# Altium project Hub.PrjPcb (part 1 of 2)
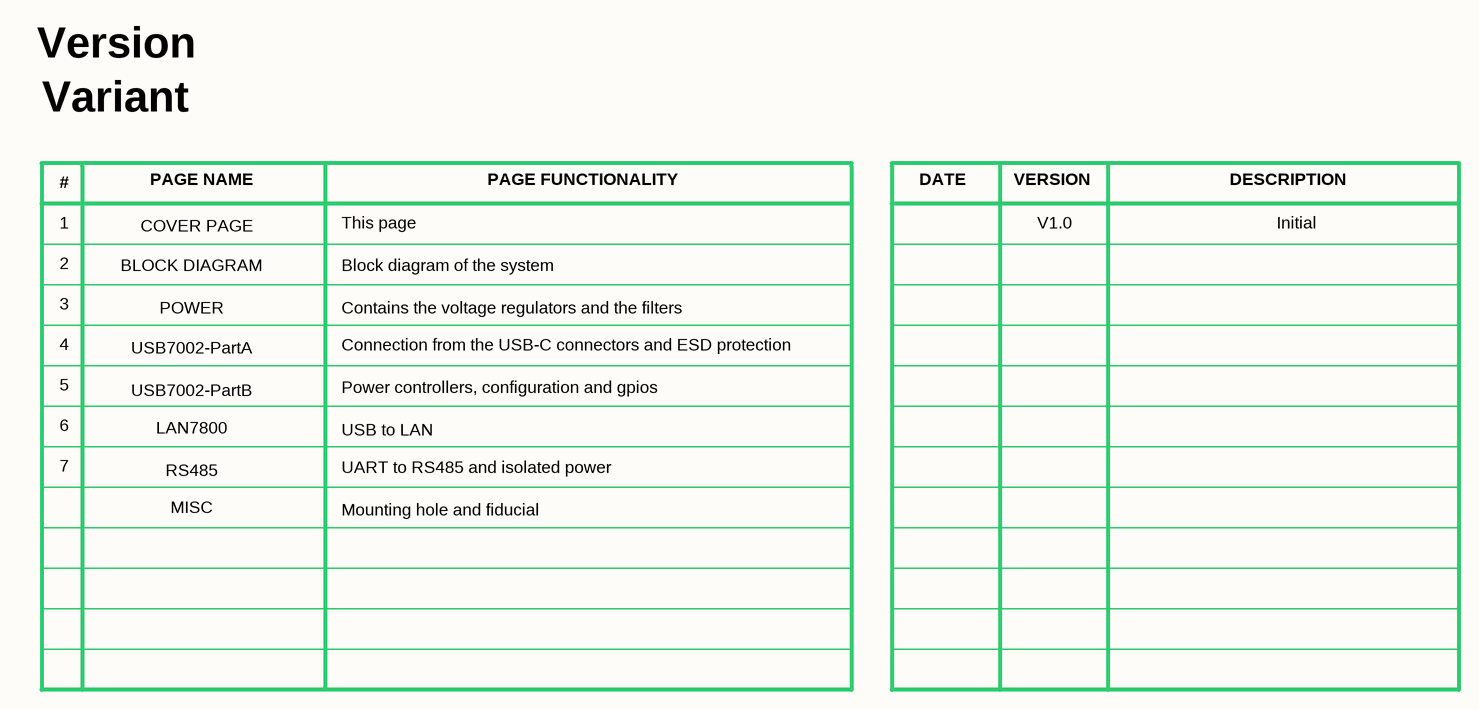
[diagram p0: 01 COVER PAGE.SchDoc]
Engineer_Name: Silard Gal; Global_version: 1.0
8 sheets, 268 parts. Net scope: flat (ports and power ports of the same name join across sheets).
Board file: PCB.PcbDoc
Sheets:
  01 COVER PAGE.SchDoc
  02 BLOCK DIAGRAM.SchDoc
  03 POWER.SchDoc
  04 USB7002-PartA.SchDoc
  05 USB7002-PartB.SchDoc
  06 LAN7800.SchDoc
  07 RS485.SchDoc
  08 MISC.SchDoc

## Sheet 01 COVER PAGE.SchDoc: COVER PAGE
size 420 x 297 mm; SheetNumber: 1; SheetTotal: 8

### Notes on the sheet
- Version
- Variant
- #
- 1
- PAGE NAME
- COVER PAGE
- This page
- PAGE FUNCTIONALITY
- DATE
- VERSION
- V1.0
- DESCRIPTION
- Initial
- 2
- POWER
- BLOCK DIAGRAM
- Contains the voltage regulators and the filters
- Block diagram of the system
- 3
- 4
- USB7002-PartA
- Connection from the USB-C connectors and ESD protection
- 5
- 6
- USB7002-PartB
- LAN7800
- Power controllers, configuration and gpios
- USB to LAN
- 7
- RS485
- MISC
- UART to RS485 and isolated power
- Mounting hole and fiducial
- Title
- Project
- Size
- Date
- Revision
- A3
- Designed By

## Sheet 02 BLOCK DIAGRAM.SchDoc: BLOCK DIAGRAM
size 420 x 297 mm; SheetNumber: 2; SheetTotal: 8
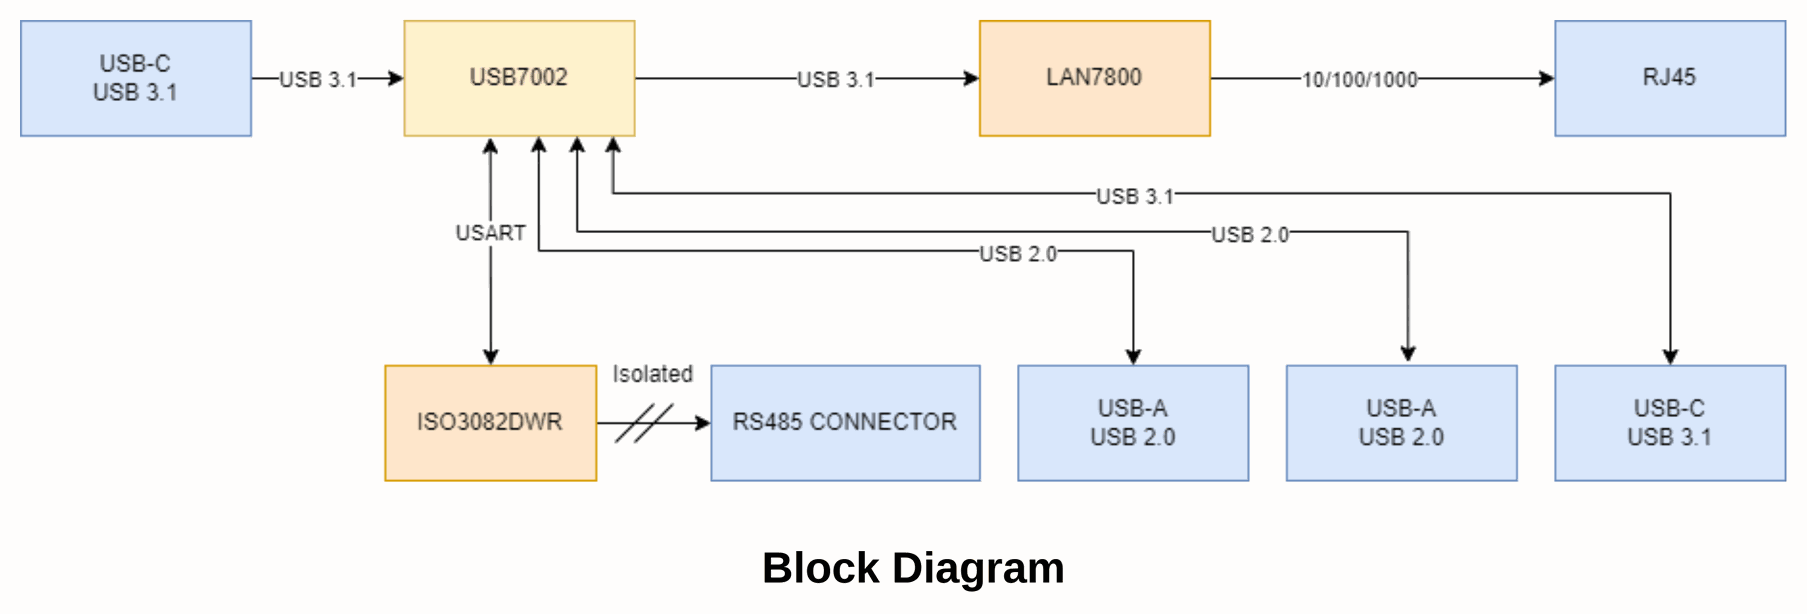
[diagram p1: 02 BLOCK DIAGRAM.SchDoc]

### Notes on the sheet
- Block Diagram
- Title
- Project
- Size
- Date
- Revision
- A3
- Designed By

## Sheet 03 POWER.SchDoc: POWER
size 420 x 297 mm; SheetNumber: 2; SheetTotal: 7
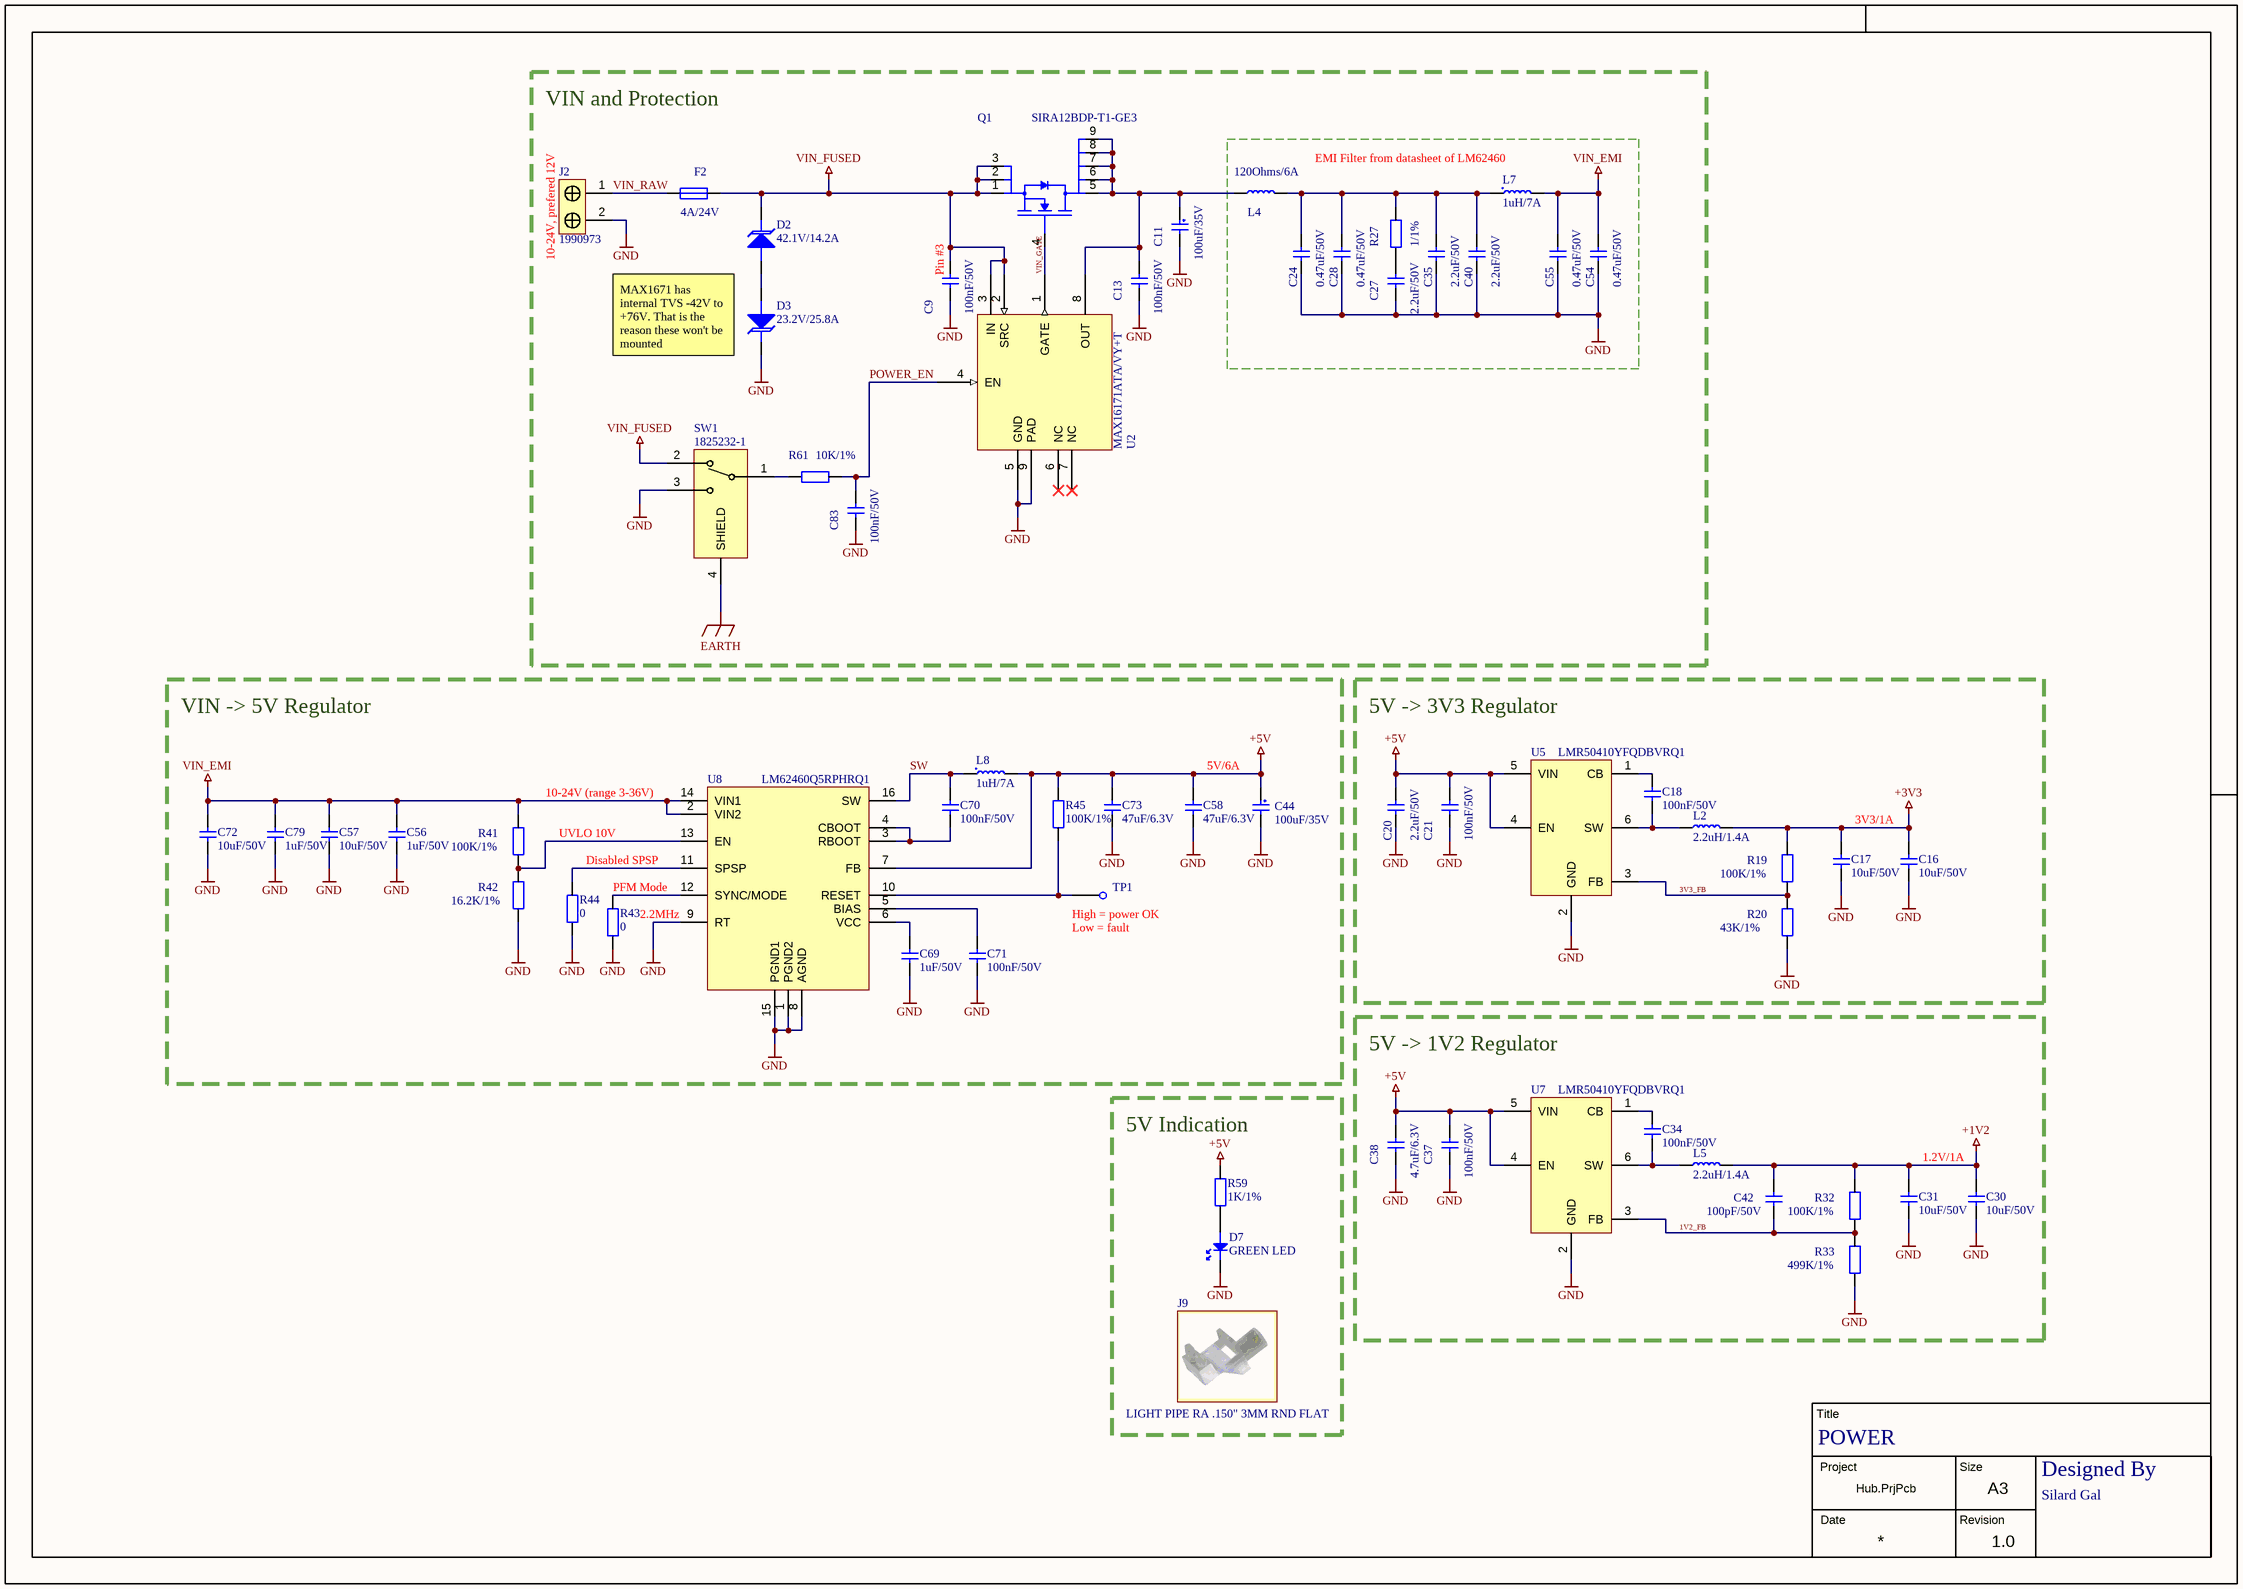
[diagram p2: 03 POWER.SchDoc]

### Parts
C9  100nF/50V  [CAPC1005X06N]
C11  100uF/35V  [CAPAE11580X70M]
C13  100nF/50V  [CAPC1005X06N]
C16  10uF/50V  [CAPC3216X18N]
C17  10uF/50V  [CAPC3216X18N]
C18  100nF/50V  [CAPC1005X06N]
C20  2.2uF/50V  [INDC1608X10N]
C21  100nF/50V  [CAPC1005X06N]
C24  0.47uF/50V  [INDC1608X10N]
C27  2.2uF/50V  [INDC1608X10N]
C28  0.47uF/50V  [INDC1608X10N]
C30  10uF/50V  [CAPC3216X18N]
C31  10uF/50V  [CAPC3216X18N]
C34  100nF/50V  [CAPC1005X06N]
C35  2.2uF/50V  [INDC1608X10N]
C37  100nF/50V  [CAPC1005X06N]
C38  4.7uF/6.3V  [CAPC1005X06N]
C40  2.2uF/50V  [INDC1608X10N]
C42  100pF/50V  [CAPC1005X06N]
C44  100uF/35V  [CAPAE11580X70M]
C54  0.47uF/50V  [INDC1608X10N]
C55  0.47uF/50V  [INDC1608X10N]
C56  1uF/50V  [INDC1608X10N]
C57  10uF/50V  [CAPC3216X18N]
C58  47uF/6.3V  [INDC1608X10N]
C69  1uF/50V  [INDC1608X10N]
C70  100nF/50V  [CAPC1005X06N]
C71  100nF/50V  [CAPC1005X06N]
C72  10uF/50V  [CAPC3216X18N]
C73  47uF/6.3V  [INDC1608X10N]
C79  1uF/50V  [INDC1608X10N]
C83  100nF/50V  [CAPC1005X06N]
D2  42.1V/14.2A  [DIOM4739X26N]
D3  23.2V/25.8A  [DIOM4739X26N]
D7  GREEN LED  [DIOC1608X06L]
F2  4A/24V  [INDC7451X08N]
J2  1990973  [1990973]
J9  LIGHT PIPE RA .150" 3MM RND FLAT  [SLP3-150-150-F]
L2  2.2uH/1.4A  [INDP2016X12N]
L4  120Ohms/6A  [INDC3216X18N]
L5  2.2uH/1.4A  [INDP2016X12N]
L7  1uH/7A  [INDP5752X20N]  (net tie)
L8  1uH/7A  [INDP5752X20N]  (net tie)
Q1  SIRA12BDP-T1-GE3  [POWERPAK-SO-8-Single]
R19  100K/1%  [RESC1005X04N]
R20  43K/1%  [RESC1005X04N]
R27  1/1%  [RESC1608X04N]
R32  100K/1%  [RESC1005X04N]
R33  499K/1%  [RESC1005X04N]
R41  100K/1%  [RESC1005X04N]
R42  16.2K/1%  [RESC1005X04N]
R43  0  [RESC1005X04N]
R44  0  [RESC1005X04N]
R45  100K/1%  [RESC1005X04N]
R59  1K/1%  [RESC1005X04N]
R61  10K/1%  [RESC1005X04N]
SW1  1825232-1  [1825232-1]
TP1  Test Point 1mm  [TEST_POINT_1mm]  (value not drawn)
U2  MAX16171ATA/VY+T  [PSON50P300X80_HS-9N]
U5  LMR50410YFQDBVRQ1  [SOT95P280X145-6N]
U7  LMR50410YFQDBVRQ1  [SOT95P280X145-6N]
U8  LM62460Q5RPHRQ1  [VQFN-HR]

### Blocks framed on the sheet
VIN and Protection: C9 C11 C13 C83 D2 D3 F2 J2 Q1 R61 SW1 U2
EMI Filter from datasheet of LM62460: C24 C27 C28 C35 C40 C54 C55 L4 L7 R27
VIN -> 5V Regulator: C44 C56-C58 C69-C73 C79 L8 R41-R45 TP1 U8
5V -> 3V3 Regulator: C16-C18 C20 C21 L2 R19 R20 U5
5V -> 1V2 Regulator: C30 C31 C34 C37 C38 C42 L5 R32 R33 U7
5V Indication: D7 J9 R59

### Nets
+1V2: C30.2 C31.2 C42.2 L5.2 R32.2
+3V3: C16.2 C17.2 L2.2 R19.2
+5V: C20.2 C21.2 C37.2 C38.2 C44.1 C58.2 C73.2 L8.2 R45.1 R59.2 U5.4(EN) U5.5(VIN) U7.4(EN) U7.5(VIN) U8.7(FB)
EARTH: SW1.4(SHIELD)
GND: C9.1 C11.2 C13.1 C16.1 C17.1 C20.1 C21.1 C24.1 C27.1 C28.1 C30.1 C31.1 C35.1 C37.1 C38.1 C40.1 C44.2 C54.1 C55.1 C56.1 C57.1 C58.1 C69.1 C71.1 C72.1 C73.1 C79.1 C83.1 D3.1 D7.1 J2.2 R20.1 R33.1 R42.1 R43.1 R44.1 SW1.3 U2.5(GND) U2.9(PAD) U5.2(GND) U7.2(GND) U8.1(PGND2) U8.8(AGND) U8.9(RT) U8.15(PGND1)
VIN_EMI: C54.2 C55.2 C56.2 C57.2 C72.2 C79.2 L7.2 R41.2 U8.2(VIN2) U8.14(VIN1)
VIN_FUSED: C9.2 D2.1 F2.2 Q1.1 Q1.2 Q1.3 SW1.2 U2.2(SRC) U2.3(IN)
1V2_FB: C42.1 R32.1 R33.2 U7.3(FB)
3V3_FB: R19.1 R20.2 U5.3(FB)
POWER_EN: C83.2 R61.2 U2.4(EN)
SW: C70.2 L8.1 U8.16(SW)
VIN_GATE: Q1.4 U2.1(GATE)
VIN_RAW: F2.1 J2.1
NetC11_1: C11.1 C13.2 L4.1 Q1.5 Q1.6 Q1.7 Q1.8 Q1.9 U2.8(OUT)
NetC18_1: C18.1 L2.1 U5.6(SW)
NetC18_2: C18.2 U5.1(CB)
NetC24_2: C24.2 C28.2 C35.2 C40.2 L4.2 L7.1 R27.2
NetC27_2: C27.2 R27.1
NetC34_1: C34.1 L5.1 U7.6(SW)
NetC34_2: C34.2 U7.1(CB)
NetC69_2: C69.2 U8.6(VCC)
NetC70_1: C70.1 U8.3(RBOOT) U8.4(CBOOT)
NetC71_2: C71.2 U8.5(BIAS)
NetD2_2: D2.2 D3.2
NetD7_2: D7.2 R59.1
NetR41_1: R41.1 R42.2 U8.13(EN)
NetR43_2: R43.2 U8.12(SYNC/MODE)
NetR44_2: R44.2 U8.11(SPSP)
NetR45_2: R45.2 TP1.1 U8.10(RESET)
NetR61_1: R61.1 SW1.1

Not connected (* = marked no-connect by the designer): U2 6(NC)* 7(NC)*

### Notes on the sheet
- (near J2) 10-24V, prefered 12V
- (near C9) Pin #3
- MAX1671 has internal TVS -42V to +76V. That is the reason these won't be mounted
- 10-24V (range 3-36V)
- 5V/6A
- UVLO 10V
- Disabled SPSP
- 3V3/1A
- (near R43) PFM Mode
- 2.2MHz
- (near TP1) High = power OK
- (near TP1) Low = fault
- 1.2V/1A
- Title
- Project
- Size
- Date
- Revision
- A3
- Designed By

### Library data of the parts
C9 C13 C18 C21 C34 C37 C70 C71 C83 = GCM155R71H104KE02J: 0.1 µF ±10% 50V Ceramic Capacitor X7R 0402 (1005 Metric); manufacturer: Murata Electronics; mfr_part_number: GCM155R71H104KE02J; assembler_number: GCM155R71H104KE02J; datasheet: https://search.murata.co.jp/Ceramy/image/img/A01X/G101/ENG/GCM155R71H104KE02-01.pdf
C11 C44 = A769KE107M1VLAS031: 100 µF 35 V Aluminum - Polymer Capacitors Radial, Can - SMD 2000 Hrs @ 125°C; manufacturer: KEMET; mfr_part_number: A769KE107M1VLAS031; assembler_number: A769KE107M1VLAS031; datasheet: https://connect.kemet.com:7667/gateway/IntelliData-ComponentDocumentation/1.0/download/datasheet/A769KE107M1VLAS031
C16 C17 C30 C31 C57 C72 = GRT31CR61H106ME01L: 10 µF ±20% 50V Ceramic Capacitor X5R 1206 (3216 Metric); manufacturer: Murata Electronics; mfr_part_number: GRT31CR61H106ME01L; assembler_number: GRT31CR61H106ME01L; datasheet: https://search.murata.co.jp/Ceramy/image/img/A01X/G101/ENG/GRT31CR61H106ME01-01.pdf
C20 C27 C35 C40 = GRT188R61H225ME13D: 2.2 µF ±20% 50V Ceramic Capacitor X5R 0603 (1608 Metric); manufacturer: Murata Electronics; mfr_part_number: GRT188R61H225ME13D; assembler_number: GRT188R61H225ME13D; datasheet: https://search.murata.co.jp/Ceramy/image/img/A01X/G101/ENG/GRT188R61H225ME13-01.pdf
C24 C28 C54 C55 = CGA3E3X7R1H474K080AB: 0.47 µF ±10% 50V Ceramic Capacitor X7R 0603 (1608 Metric); manufacturer: TDK Corporation; mfr_part_number: CGA3E3X7R1H474K080AB; assembler_number: CGA3E3X7R1H474K080AB; datasheet: https://product.tdk.com/system/files/dam/doc/product/capacitor/ceramic/mlcc/catalog/mlcc_automotive_general_en.pdf
C38 = JMK105BBJ475MVHF: 4.7 µF ±20% 6.3V Ceramic Capacitor X5R 0402 (1005 Metric); manufacturer: Taiyo Yuden; mfr_part_number: JMK105BBJ475MVHF; assembler_number: JMK105BBJ475MVHF; datasheet: https://media.digikey.com/pdf/Data%20Sheets/Taiyo%20Yuden%20PDFs%20URL%20links/JMK105BBJ475MVHF_SS.pdf
C42 = GCM1555C1H101JA16D: 100 pF ±5% 50V Ceramic Capacitor C0G, NP0 0402 (1005 Metric); manufacturer: Murata Electronics; mfr_part_number: GCM1555C1H101JA16D; assembler_number: GCM1555C1H101JA16D; datasheet: https://www.murata.com/-/media/webrenewal/support/library/catalog/products/k35e.ashx?la=en-us&cvid=20200508021757000000
C56 C69 C79 = GRT188R61H105KE13D: 1 µF ±10% 50V Ceramic Capacitor X5R 0603 (1608 Metric); manufacturer: Murata Electronics; mfr_part_number: GRT188R61H105KE13D; assembler_number: GRT188R61H105KE13D; datasheet: https://search.murata.co.jp/Ceramy/image/img/A01X/G101/ENG/GRT188R61H105KE13-01.pdf
C58 C73 = GRM188R60J476ME15D: 47 µF ±20% 6.3V Ceramic Capacitor X5R 0603 (1608 Metric); manufacturer: Murata Electronics; mfr_part_number: GRM188R60J476ME15D; assembler_number: GRM188R60J476ME15D; datasheet: https://search.murata.co.jp/Ceramy/image/img/A01X/G101/ENG/GRM188R60J476ME15-01.pdf
D2 = SMBJ26A-13-F: 42.1V Clamp 14.2A Ipp Tvs Diode Surface Mount SMB; manufacturer: Diodes Incorporated; mfr_part_number: SMBJ26A-13-F; assembler_number: SMBJ26A-13-F; datasheet: https://www.diodes.com/assets/Datasheets/ds19002.pdf
D3 = SMBJ14A-13-F: 23.2V Clamp 25.8A Ipp Tvs Diode Surface Mount SMB; manufacturer: Diodes Incorporated; mfr_part_number: SMBJ14A-13-F; assembler_number: SMBJ14A-13-F; datasheet: https://www.diodes.com/assets/Datasheets/ds19002.pdf
D7 = LTST-C191KGKT: White 0402 Light Emitting Diodes (LED) RoHS; manufacturer: Lite-On Inc.; mfr_part_number: LTST-C191KGKT; assembler_number: LTST-C191KGKT; datasheet: https://optoelectronics.liteon.com/upload/download/DS22-2000-228/LTST-C191KGKT.PDF
F2 = 0ZCF0200AF2C: Polymeric PTC Resettable Fuse 24V 2 A Ih Surface Mount 2920 (7351 Metric), Concave - 4A trip; manufacturer: Bel Fuse Inc.; mfr_part_number: 0ZCF0200AF2C; assembler_number: 0ZCF0200AF2C; datasheet: https://www.belfuse.com/resources/datasheets/circuitprotection/ds-cp-0zcf-series.pdf
J2 = 1990973: 2 Position Wire to Board Terminal Block Horizontal with Board 0.197" (5.00mm) Through Hole; manufacturer: Phoenix Contact; mfr_part_number: 1990973; assembler_number: 1990973; datasheet: https://www.phoenixcontact.com/en-pc/products/pcb-terminal-block-spt-25-2-h-50-1990973
J9 = SLP3-150-150-F: Light Pipe Single Clear Rigid Board Mount, Press Fit, Right Angle; manufacturer: Bivar Inc.; mfr_part_number: SLP3-150-150-F; assembler_number: SLP3-150-150-F; datasheet: https://www.bivar.com/parts_content/Datasheets/SLP3-150-XXX-X.pdf
L2 L5 = TYA2016102R2M-10: 2.2 µH Shielded Drum Core, Wirewound Inductor 1.4 A 180mOhm Max 0806 (2016 Metric); manufacturer: Laird-Signal Integrity Products; mfr_part_number: TYA2016102R2M-10; assembler_number: TYA2016102R2M-10; datasheet: https://www.laird.com/sites/default/files/tya201610-series-datasheet.pdf
L4 = BLM31KN121SN1L: 120 Ohms @ 100 MHz 1 Power Line Ferrite Bead 1206 (3216 Metric) 6A 9mOhm; manufacturer: Murata Electronics; mfr_part_number: BLM31KN121SN1L; assembler_number: BLM31KN121SN1L; datasheet: https://www.murata.com/en-us/products/productdata/8801529331742/ENFA0091.pdf
L7 L8 = SRP5020TA-1R0M: 1 µH Shielded Drum Core, Wirewound Inductor 7 A 20mOhm Max Nonstandard; manufacturer: Bourns Inc.; mfr_part_number: SRP5020TA-1R0M; assembler_number: SRP5020TA-1R0M; datasheet: https://www.bourns.com/docs/Product-Datasheets/SRP5020TA.pdf
Q1 = SIRA12BDP-T1-GE3: N-Channel 30 V 27A (Ta), 60A (Tc) 5W (Ta), 38W (Tc) Surface Mount PowerPAK® SO-8; manufacturer: Vishay Siliconix; mfr_part_number: SIRA12BDP-T1-GE3; assembler_number: SIRA12BDP-T1-GE3; datasheet: https://www.vishay.com/docs/76390/sira12bdp.pdf
R19 R32 R41 R45 = RMCF0402FT100K: 100 kOhms ±1% 0.063W, 1/16W Chip Resistor 0402 (1005 Metric) Automotive AEC-Q200 Thick Film; manufacturer: Stackpole Electronics Inc; mfr_part_number: RMCF0402FT100K; assembler_number: RMCF0402FT100K; datasheet: https://www.seielect.com/Catalog/SEI-RMCF_RMCP.pdf
R20 = ERJ-2RKF4302X: 43 kOhms ±1% 0.1W, 1/10W Chip Resistor 0402 (1005 Metric) Automotive AEC-Q200 Thick Film; manufacturer: Panasonic Electronic Components; mfr_part_number: ERJ-2RKF4302X; assembler_number: ERJ-2RKF4302X; datasheet: https://industrial.panasonic.com/cdbs/www-data/pdf/RDA0000/AOA0000C304.pdf
R27 = RMCF0603FT1R00: 1 Ohms ±1% 0.1W, 1/10W Chip Resistor 0603 (1608 Metric) Automotive AEC-Q200 Thick Film; manufacturer: Stackpole Electronics Inc; mfr_part_number: RMCF0603FT1R00; assembler_number: RMCF0603FT1R00; datasheet: https://www.seielect.com/Catalog/SEI-RMCF_RMCP.pdf
R33 = RMCF0402FT499K: 499 kOhms ±1% 0.063W, 1/16W Chip Resistor 0402 (1005 Metric) Automotive AEC-Q200 Thick Film; manufacturer: Stackpole Electronics Inc; mfr_part_number: RMCF0402FT499K; assembler_number: RMCF0402FT499K; datasheet: https://www.seielect.com/Catalog/SEI-RMCF_RMCP.pdf
R42 = ERJ-2RKF1622X: 16.2 kOhms ±1% 0.1W, 1/10W Chip Resistor 0402 (1005 Metric) Automotive AEC-Q200 Thick Film; manufacturer: Panasonic Electronic Components; mfr_part_number: ERJ-2RKF1622X; assembler_number: ERJ-2RKF1622X; datasheet: https://industrial.panasonic.com/cdbs/www-data/pdf/RDA0000/AOA0000C304.pdf
R43 R44 = 0402WGF0000TCE: 62.5mW Thick Film Resistors 50V ±800ppm/℃ ±1% -55℃~+155℃ 0Ω 0402  Chip Resistor - Surface Mount ROHS; manufacturer: UNI-ROYAL(Uniroyal Elec); assembler_number: C17168; mfr_part_number: 0402WGF0000TCE; datasheet: https://datasheet.lcsc.com/lcsc/2206010216_UNI-ROYAL-Uniroyal-Elec-0402WGF0000TCE_C17168.pdf
R59 = RMCF0402FT1K00: 1 kOhms ±1% 0.063W, 1/16W Chip Resistor 0402 (1005 Metric) Automotive AEC-Q200 Thick Film; manufacturer: Stackpole Electronics Inc; mfr_part_number: RMCF0402FT1K00; assembler_number: RMCF0402FT1K00; datasheet: https://www.seielect.com/Catalog/SEI-RMCF_RMCP.pdf
R61 = RMCF0402FT10K0: 10 kOhms ±1% 0.063W, 1/16W Chip Resistor 0402 (1005 Metric) Automotive AEC-Q200 Thick Film; manufacturer: Stackpole Electronics Inc; mfr_part_number: RMCF0402FT10K0; assembler_number: RMCF0402FT10K0; datasheet: https://www.seielect.com/Catalog/SEI-RMCF_RMCP.pdf
SW1 = 1825232-1: Slide Switch SPDT Through Hole, Right Angle; manufacturer: TE Connectivity ALCOSWITCH Switches; mfr_part_number: 1825232-1; assembler_number: 1825232-1; datasheet: https://www.te.com/commerce/DocumentDelivery/DDEController?Action=srchrtrv&DocNm=1825232&DocType=Customer+Drawing&DocLang=English&DocFormat=pdf&PartCntxt=1825232-1
TP1 = TestPoint
U2 = MAX16171ATA/VY+T: OR Controller N+1 ORing Controller N-Channel 1:1 8-TDFN-CU (2x3); manufacturer: Analog Devices Inc./Maxim Integrated; mfr_part_number: MAX16171ATA/VY+T; assembler_number: MAX16171ATA/VY+T; datasheet: https://datasheets.maximintegrated.com/en/ds/MAX16171.pdf
U5 U7 = LMR50410YFQDBVRQ1: Buck Switching Regulator IC Positive Adjustable 1V 1 Output 1A SOT-23-6; manufacturer: Texas Instruments; mfr_part_number: LMR50410YFQDBVRQ1; assembler_number: LMR50410YFQDBVRQ1; datasheet: https://www.ti.com/lit/ds/symlink/lmr50410-q1.pdf
U8 = LM62460Q5RPHRQ1: Switching Voltage Regulators 6-A automotive buck converter optimized for power density and low EMI; manufacturer: Texas Instruments; mfr_part_number: LM62460Q5RPHRQ1; assembler_number: LM62460Q5RPHRQ1; datasheet: https://www.ti.com/general/docs/suppproductinfo.tsp?distId=26&gotoUrl=https://www.ti.com/lit/gpn/lm62460-q1

## Sheet 04 USB7002-PartA.SchDoc: USB7002 - Part A
size 420 x 297 mm; SheetNumber: 3; SheetTotal: 7
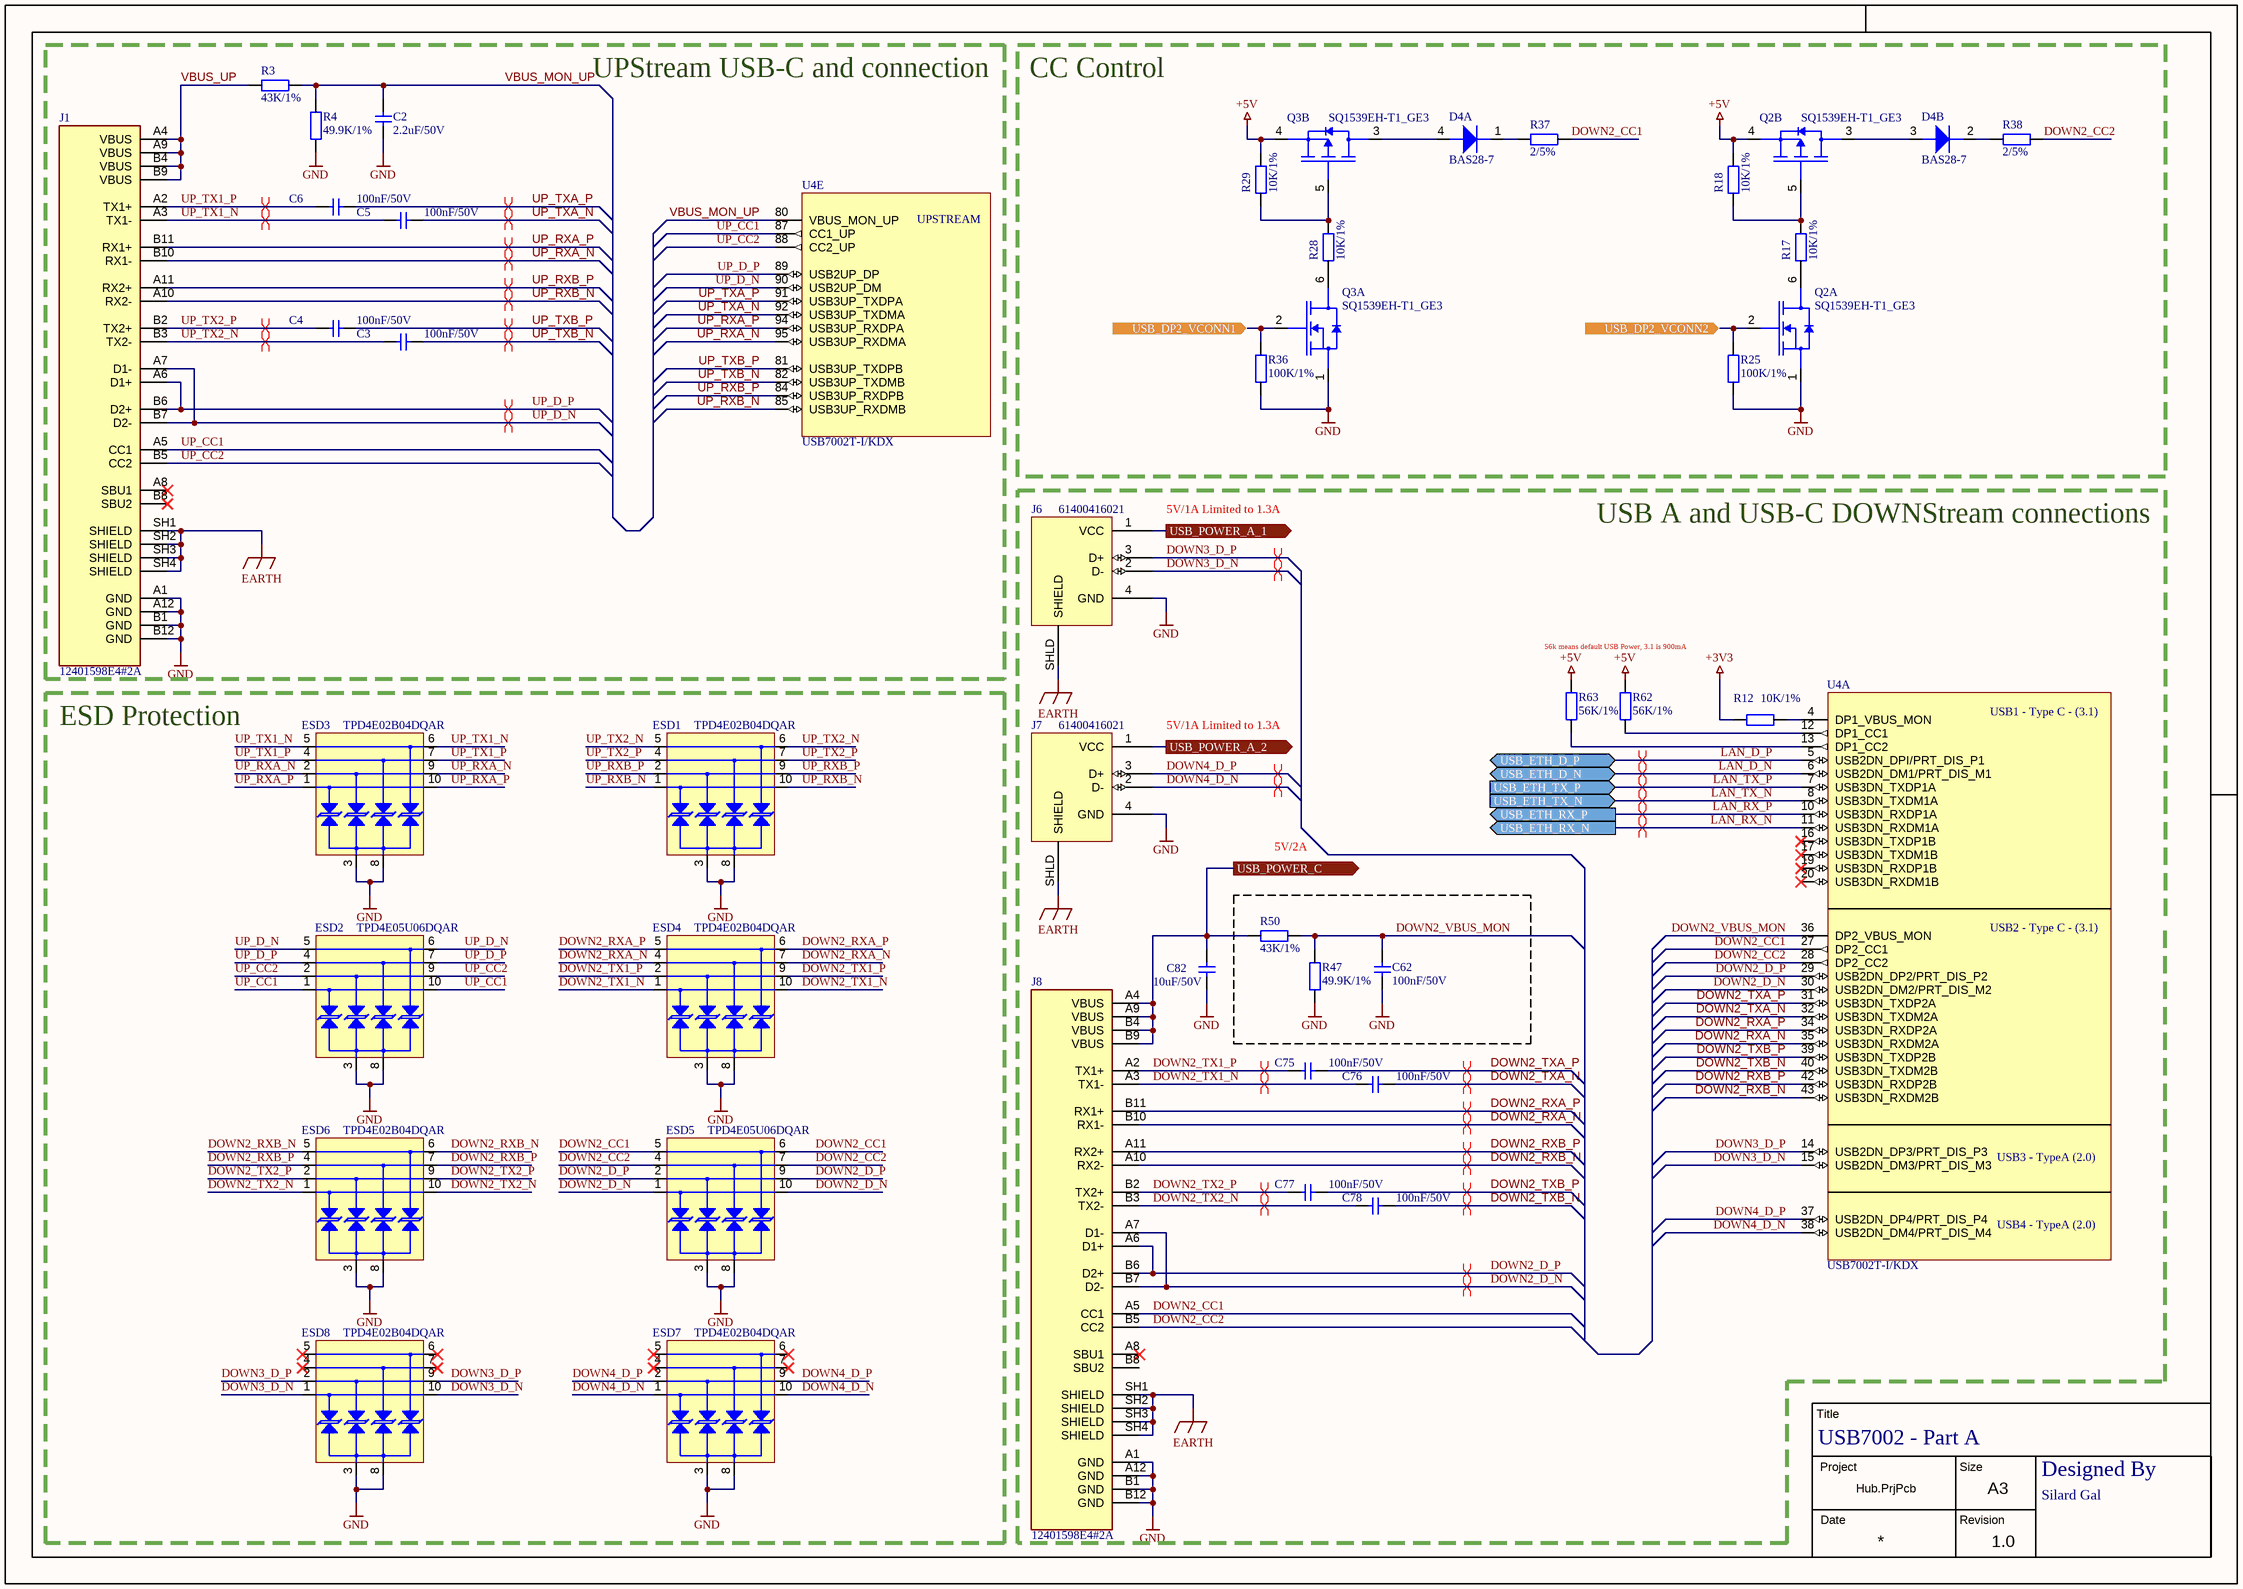
[diagram p3: 04 USB7002-PartA.SchDoc]

### Parts
C2  2.2uF/50V  [INDC1608X10N]
C3  100nF/50V  [CAPC1005X06N]
C4  100nF/50V  [CAPC1005X06N]
C5  100nF/50V  [CAPC1005X06N]
C6  100nF/50V  [CAPC1005X06N]
C62  100nF/50V  [CAPC1005X06N]
C75  100nF/50V  [CAPC1005X06N]
C76  100nF/50V  [CAPC1005X06N]
C77  100nF/50V  [CAPC1005X06N]
C78  100nF/50V  [CAPC1005X06N]
C82  10uF/50V  [CAPC3216X18N]
D4  BAS28-7  [SOT190P238X100-4L]  (parts A,B of 2)
ESD1  TPD4E02B04DQAR  [USON50P11X26X055]
ESD2  TPD4E05U06DQAR  [USON50P11X26X055]
ESD3  TPD4E02B04DQAR  [USON50P11X26X055]
ESD4  TPD4E02B04DQAR  [USON50P11X26X055]
ESD5  TPD4E05U06DQAR  [USON50P11X26X055]
ESD6  TPD4E02B04DQAR  [USON50P11X26X055]
ESD7  TPD4E02B04DQAR  [USON50P11X26X055]
ESD8  TPD4E02B04DQAR  [USON50P11X26X055]
J1  12401598E4#2A  [12401598E4#2A]
J6  61400416021  [61400416021]
J7  61400416021  [61400416021]
J8  12401598E4#2A  [12401598E4#2A]
Q2  SQ1539EH-T1_GE3  [SOT65P195X110-6N]  (parts A,B of 2)
Q3  SQ1539EH-T1_GE3  [SOT65P195X110-6N]  (parts A,B of 2)
R3  43K/1%  [RESC1005X04N]
R4  49.9K/1%  [RESC1005X04N]
R12  10K/1%  [RESC1005X04N]
R17  10K/1%  [RESC1005X04N]
R18  10K/1%  [RESC1005X04N]
R25  100K/1%  [RESC1005X04N]
R28  10K/1%  [RESC1005X04N]
R29  10K/1%  [RESC1005X04N]
R36  100K/1%  [RESC1005X04N]
R37  2/5%  [RESC1608X04N]
R38  2/5%  [RESC1608X04N]
R47  49.9K/1%  [RESC1005X04N]
R50  43K/1%  [RESC1005X04N]
R62  56K/1%  [RESC1005X04N]
R63  56K/1%  [RESC1005X04N]
U4  USB7002T-I/KDX  [QFN40P1200X1200X90_HS-101N]  (parts A,E of 5)

### Blocks framed on the sheet
UPStream USB-C and connection: C2-C6 J1 R3 R4 U4
CC Control: D4 Q2 Q3 R17 R18 R25 R28 R29 R36-R38
USB A and USB-C DOWNStream connections: C62 C75-C78 C82 J6-J8 R12 R47 R50 R62 R63 U4
ESD Protection: ESD1-ESD8

### Ports
USB_DP2_VCONN1 (in), USB_DP2_VCONN2 (in), USB_ETH_D_N (bidir), USB_ETH_D_P (bidir), USB_ETH_RX_N (out), USB_ETH_RX_P (out), USB_ETH_TX_N (in), USB_ETH_TX_P (in), USB_POWER_A_1 (out), USB_POWER_A_2 (out), USB_POWER_C (out)

### Nets
+3V3: R12.1
+5V: Q2.4 Q3.4 R18.1 R29.1 R62.1 R63.1
EARTH: J1.SH1(SHIELD) J1.SH2(SHIELD) J1.SH3(SHIELD) J1.SH4(SHIELD) J6.SHLD(SHIELD) J7.SHLD(SHIELD) J8.SH1(SHIELD) J8.SH2(SHIELD) J8.SH3(SHIELD) J8.SH4(SHIELD)
GND: C2.1 C62.2 C82.1 ESD1.3(GND) ESD1.8(GND) ESD2.3(GND) ESD2.8(GND) ESD3.3(GND) ESD3.8(GND) ESD4.3(GND) ESD4.8(GND) ESD5.3(GND) ESD5.8(GND) ESD6.3(GND) ESD6.8(GND) ESD7.3(GND) ESD7.8(GND) ESD8.3(GND) ESD8.8(GND) J1.A1(GND) J1.A12(GND) J1.B1(GND) J1.B12(GND) J6.4(GND) J7.4(GND) J8.A1(GND) J8.A12(GND) J8.B1(GND) J8.B12(GND) Q2.1(S1) Q3.1(S1) R4.1 R25.2 R36.2 R47.1
DOWN2_CC1: ESD5.5(IO4) ESD5.6(NC) J8.A5(CC1) R37.2 U4.27(DP2_CC1)
DOWN2_CC2: ESD5.4(IO3) ESD5.7(NC) J8.B5(CC2) R38.2 U4.28(DP2_CC2)
DOWN2_D_N: ESD5.1(IO1) ESD5.10(NC) J8.A7(D1-) J8.B7(D2-) U4.30(USB2DN_DM2/PRT_DIS_M2)
DOWN2_D_P: ESD5.2(IO2) ESD5.9(NC) J8.A6(D1+) J8.B6(D2+) U4.29(USB2DN_DP2/PRT_DIS_P2)
DOWN2_RXA_N: ESD4.4(IO3) ESD4.7(NC) J8.B10(RX1-) U4.35(USB3DN_RXDM2A)
DOWN2_RXA_P: ESD4.5(IO4) ESD4.6(NC) J8.B11(RX1+) U4.34(USB3DN_RXDP2A)
DOWN2_RXB_N: ESD6.5(IO4) ESD6.6(NC) J8.A10(RX2-) U4.43(USB3DN_RXDM2B)
DOWN2_RXB_P: ESD6.4(IO3) ESD6.7(NC) J8.A11(RX2+) U4.42(USB3DN_RXDP2B)
DOWN2_TX1_N: C76.2 ESD4.1(IO1) ESD4.10(NC) J8.A3(TX1-)
DOWN2_TX1_P: C75.2 ESD4.2(IO2) ESD4.9(NC) J8.A2(TX1+)
DOWN2_TX2_N: C78.2 ESD6.1(IO1) ESD6.10(NC) J8.B3(TX2-)
DOWN2_TX2_P: C77.2 ESD6.2(IO2) ESD6.9(NC) J8.B2(TX2+)
DOWN2_TXA_N: C76.1 U4.32(USB3DN_TXDM2A)
DOWN2_TXA_P: C75.1 U4.31(USB3DN_TXDP2A)
DOWN2_TXB_N: C78.1 U4.40(USB3DN_TXDM2B)
DOWN2_TXB_P: C77.1 U4.39(USB3DN_TXDP2B)
DOWN2_VBUS_MON: C62.1 R47.2 R50.1 U4.36(DP2_VBUS_MON)
DOWN3_D_N: ESD8.1(IO1) ESD8.10(NC) J6.2(D-) U4.15(USB2DN_DM3/PRT_DIS_M3)
DOWN3_D_P: ESD8.2(IO2) ESD8.9(NC) J6.3(D+) U4.14(USB2DN_DP3/PRT_DIS_P3)
DOWN4_D_N: ESD7.1(IO1) ESD7.10(NC) J7.2(D-) U4.38(USB2DN_DM4/PRT_DIS_M4)
DOWN4_D_P: ESD7.2(IO2) ESD7.9(NC) J7.3(D+) U4.37(USB2DN_DP4/PRT_DIS_P4)
LAN_D_N: U4.6(USB2DN_DM1/PRT_DIS_M1) ; port USB_ETH_D_N
LAN_D_P: U4.5(USB2DN_DPI/PRT_DIS_P1) ; port USB_ETH_D_P
LAN_RX_N: U4.11(USB3DN_RXDM1A) ; port USB_ETH_RX_N
LAN_RX_P: U4.10(USB3DN_RXDP1A) ; port USB_ETH_RX_P
LAN_TX_N: U4.8(USB3DN_TXDM1A) ; port USB_ETH_TX_N
LAN_TX_P: U4.7(USB3DN_TXDP1A) ; port USB_ETH_TX_P
UP_CC1: ESD2.1(IO1) ESD2.10(NC) J1.A5(CC1) U4.87(CC1_UP)
UP_CC2: ESD2.2(IO2) ESD2.9(NC) J1.B5(CC2) U4.88(CC2_UP)
UP_D_N: ESD2.5(IO4) ESD2.6(NC) J1.A7(D1-) J1.B7(D2-) U4.90(USB2UP_DM)
UP_D_P: ESD2.4(IO3) ESD2.7(NC) J1.A6(D1+) J1.B6(D2+) U4.89(USB2UP_DP)
UP_RXA_N: ESD3.2(IO2) ESD3.9(NC) J1.B10(RX1-) U4.95(USB3UP_RXDMA)
UP_RXA_P: ESD3.1(IO1) ESD3.10(NC) J1.B11(RX1+) U4.94(USB3UP_RXDPA)
UP_RXB_N: ESD1.1(IO1) ESD1.10(NC) J1.A10(RX2-) U4.85(USB3UP_RXDMB)
UP_RXB_P: ESD1.2(IO2) ESD1.9(NC) J1.A11(RX2+) U4.84(USB3UP_RXDPB)
UP_TX1_N: C5.2 ESD3.5(IO4) ESD3.6(NC) J1.A3(TX1-)
UP_TX1_P: C6.2 ESD3.4(IO3) ESD3.7(NC) J1.A2(TX1+)
UP_TX2_N: C3.2 ESD1.5(IO4) ESD1.6(NC) J1.B3(TX2-)
UP_TX2_P: C4.2 ESD1.4(IO3) ESD1.7(NC) J1.B2(TX2+)
UP_TXA_N: C5.1 U4.92(USB3UP_TXDMA)
UP_TXA_P: C6.1 U4.91(USB3UP_TXDPA)
UP_TXB_N: C3.1 U4.82(USB3UP_TXDMB)
UP_TXB_P: C4.1 U4.81(USB3UP_TXDPB)
VBUS_MON_UP: C2.2 R3.1 R4.2 U4.80(VBUS_MON_UP)
VBUS_UP: J1.A4(VBUS) J1.A9(VBUS) J1.B4(VBUS) J1.B9(VBUS) R3.2
NetC66_1: J6.1(VCC) ; port USB_POWER_A_1
NetC67_1: J7.1(VCC) ; port USB_POWER_A_2
NetC68_1: C82.2 J8.A4(VBUS) J8.A9(VBUS) J8.B4(VBUS) J8.B9(VBUS) R50.2 ; port USB_POWER_C
NetD4_1: D4.1 R37.1
NetD4_2: D4.2 R38.1
NetD4_3: D4.3 Q2.3
NetD4_4: D4.4 Q3.3
NetQ2_2: Q2.2(S2) R25.1 ; port USB_DP2_VCONN2
NetQ2_5: Q2.5 R17.1 R18.2
NetQ2_6: Q2.6 R17.2
NetQ3_2: Q3.2(S2) R36.1 ; port USB_DP2_VCONN1
NetQ3_5: Q3.5 R28.1 R29.2
NetQ3_6: Q3.6 R28.2
NetR12_2: R12.2 U4.4(DP1_VBUS_MON)
NetR62_2: R62.2 U4.12(DP1_CC1)
NetR63_2: R63.2 U4.13(DP1_CC2)

Not connected (* = marked no-connect by the designer): ESD7 4(IO3)* 5(IO4)* 6(NC)* 7(NC)*; ESD8 4(IO3)* 5(IO4)* 6(NC)* 7(NC)*; J1 A8(SBU1)* B8(SBU2)*; J8 A8(SBU1)* B8(SBU2); U4 16(USB3DN_TXDP1B)* 17(USB3DN_TXDM1B)* 19(USB3DN_RXDP1B)* 20(USB3DN_RXDM1B)*

### Layout directives
differential pair; differential pair class UP_SS: UP_RXA_N, UP_RXA_P, UP_RXB_N, UP_RXB_P, UP_TX1_N, UP_TX1_P, UP_TX2_N, UP_TX2_P, UP_TXA_N, UP_TXA_P, UP_TXB_N, UP_TXB_P
differential pair; differential pair class UP_DPDN: UP_D_N, UP_D_P
differential pair; differential pair class DOWN2_SS: DOWN2_RXA_N, DOWN2_RXA_P, DOWN2_RXB_N, DOWN2_RXB_P, DOWN2_TX1_N, DOWN2_TX1_P, DOWN2_TX2_N, DOWN2_TX2_P, DOWN2_TXA_N, DOWN2_TXA_P, DOWN2_TXB_N, DOWN2_TXB_P
differential pair; differential pair class DOWN2_DPDM: DOWN2_D_N, DOWN2_D_P
differential pair; differential pair class DOWN3_DPDN: DOWN3_D_N, DOWN3_D_P
differential pair; differential pair class DOWN4_DPDN: DOWN4_D_N, DOWN4_D_P
differential pair; differential pair class USB_ETH: LAN_D_N, LAN_D_P
differential pair; differential pair class USB_ETH_SS: LAN_RX_N, LAN_RX_P, LAN_TX_N, LAN_TX_P

### Notes on the sheet
- 5V/1A Limited to 1.3A
- 56k means default USB Power, 3.1 is 900mA
- 5V/2A
- Title
- Project
- Size
- Date
- Revision
- A3
- Designed By
- (in symbol USB7002T-I/KDX, part A) USB1 - Type C - (3.1); USB2 - Type C - (3.1); USB3 - TypeA (2.0); USB4 - TypeA (2.0)
- (in symbol USB7002T-I/KDX, part E) UPSTREAM

### Library data of the parts
C2 = GRT188R61H225ME13D: as C20 on sheet 03 POWER; mfr_part_number: GRT188R61H225ME13D; assembler_number: GRT188R61H225ME13D; datasheet: https://search.murata.co.jp/Ceramy/image/img/A01X/G101/ENG/GRT188R61H225ME13-01.pdf
C3-C6 C62 C75-C78 = GCM155R71H104KE02J: as C9 on sheet 03 POWER; mfr_part_number: GCM155R71H104KE02J; assembler_number: GCM155R71H104KE02J; datasheet: https://search.murata.co.jp/Ceramy/image/img/A01X/G101/ENG/GCM155R71H104KE02-01.pdf
C82 = GRT31CR61H106ME01L: as C16 on sheet 03 POWER; mfr_part_number: GRT31CR61H106ME01L; assembler_number: GRT31CR61H106ME01L; datasheet: https://search.murata.co.jp/Ceramy/image/img/A01X/G101/ENG/GRT31CR61H106ME01-01.pdf
D4 = BAS28-7: Diode Array 2 Independent 85 V 215mA (DC) Surface Mount TO-253-4, TO-253AA; manufacturer: Diodes Incorporated; mfr_part_number: BAS28-7; assembler_number: BAS28-7; datasheet: https://www.diodes.com/assets/Datasheets/BAS28.pdf
ESD1 ESD3 ESD4 ESD6-ESD8 = TPD4E02B04DQAR: 8.8V (Typ) Clamp 5A (8/20µs) Ipp Tvs Diode Surface Mount 10-USON (2.5x1); manufacturer: Texas Instruments; mfr_part_number: TPD4E02B04DQAR; assembler_number: TPD4E02B04DQAR; datasheet: https://www.ti.com/general/docs/suppproductinfo.tsp?distId=10&gotoUrl=https%3A%2F%2Fwww.ti.com%2Flit%2Fgpn%2Ftpd4e05u06
ESD2 ESD5 = TPD4E05U06DQAR: 14V Clamp 2.5A (8/20µs) Ipp Tvs Diode Surface Mount 10-USON (2.5x1); manufacturer: Texas Instruments; mfr_part_number: TPD4E05U06DQAR; assembler_number: TPD4E05U06DQAR; datasheet: https://www.ti.com/general/docs/suppproductinfo.tsp?distId=10&gotoUrl=https%3A%2F%2Fwww.ti.com%2Flit%2Fgpn%2Ftpd4e05u06
J1 J8 = 12401598E4#2A: USB-C (USB TYPE-C) USB 3.2 Gen 2 (USB 3.1 Gen 2, Superspeed + (USB 3.1)) Receptacle Connector 24 Position Surface Mount, Right Angle; Through Hole; manufacturer: Amphenol ICC (Commercial Products); mfr_part_number: 12401598E4#2A; assembler_number: 12401598E4#2A; datasheet: https://www.amphenol-cs.com/media/wysiwyg/files/drawing/12401598xxx2a.pdf
J6 J7 = 61400416021: USB-A (USB TYPE-A) USB 2.0 Receptacle Connector 4 Position Through Hole, Right Angle; manufacturer: Würth Elektronik; mfr_part_number: 61400416021; assembler_number: 61400416021; datasheet: https://media.digikey.com/pdf/Data%20Sheets/Wurth%20Electronics%20PDFs/Communication%20Conn%20WR-COM.pdf
Q2 Q3 = SQ1539EH-T1_GE3: Mosfet Array 30V 850mA (Tc) 1.5W Surface Mount PowerPAK® SC-70-6 Dual; manufacturer: Vishay Siliconix; mfr_part_number: SQ1539EH-T1_GE3; assembler_number: SQ1539EH-T1_GE3; datasheet: https://www.vishay.com/docs/62993/sq1539eh.pdf
R3 R50 = ERJ-2RKF4302X: as R20 on sheet 03 POWER; mfr_part_number: ERJ-2RKF4302X; assembler_number: ERJ-2RKF4302X; datasheet: https://industrial.panasonic.com/cdbs/www-data/pdf/RDA0000/AOA0000C304.pdf
R4 R47 = ERJ-2RKF4992X: 49.9 kOhms ±1% 0.1W, 1/10W Chip Resistor 0402 (1005 Metric) Automotive AEC-Q200 Thick Film; manufacturer: Panasonic Electronic Components; mfr_part_number: ERJ-2RKF4992X; assembler_number: ERJ-2RKF4992X; datasheet: https://industrial.panasonic.com/cdbs/www-data/pdf/RDA0000/AOA0000C304.pdf
R12 R17 R18 R28 R29 = RMCF0402FT10K0: as R61 on sheet 03 POWER; mfr_part_number: RMCF0402FT10K0; assembler_number: RMCF0402FT10K0; datasheet: https://www.seielect.com/Catalog/SEI-RMCF_RMCP.pdf
R25 R36 = RMCF0402FT100K: as R19 on sheet 03 POWER; mfr_part_number: RMCF0402FT100K; assembler_number: RMCF0402FT100K; datasheet: https://www.seielect.com/Catalog/SEI-RMCF_RMCP.pdf
R37 R38 = ERJ-PA3J2R0V: 2 Ohms ±5% 0.333W, 1/3W Chip Resistor 0603 (1608 Metric) Automotive AEC-Q200, Pulse Withstanding Thick Film; manufacturer: Panasonic Electronic Components; mfr_part_number: ERJ-PA3J2R0V; assembler_number: ERJ-PA3J2R0V; datasheet: https://industrial.panasonic.com/cdbs/www-data/pdf/RDO0000/AOA0000C331.pdf
R62 R63 = ERJ-2RKF5602X: 56 kOhms ±1% 0.1W, 1/10W Chip Resistor 0402 (1005 Metric) Automotive AEC-Q200 Thick Film; manufacturer: Panasonic Electronic Components; mfr_part_number: ERJ-2RKF5602X; assembler_number: ERJ-2RKF5602X; datasheet: https://industrial.panasonic.com/cdbs/www-data/pdf/RDA0000/AOA0000C304.pdf
U4 = USB7002T-I/KDX: USB Hub Controller USB 3.1 USB Interface 100-VQFN (12x12); manufacturer: Microchip Technology; mfr_part_number: USB7002T-I/KDX; assembler_number: USB7002T-I/KDX; datasheet: https://ww1.microchip.com/downloads/en/DeviceDoc/USB7002-Data-Sheet-DS00002670F.pdf

## Sheet 05 USB7002-PartB.SchDoc: USB7002 - Part B
size 420 x 297 mm; SheetNumber: 4; SheetTotal: 7
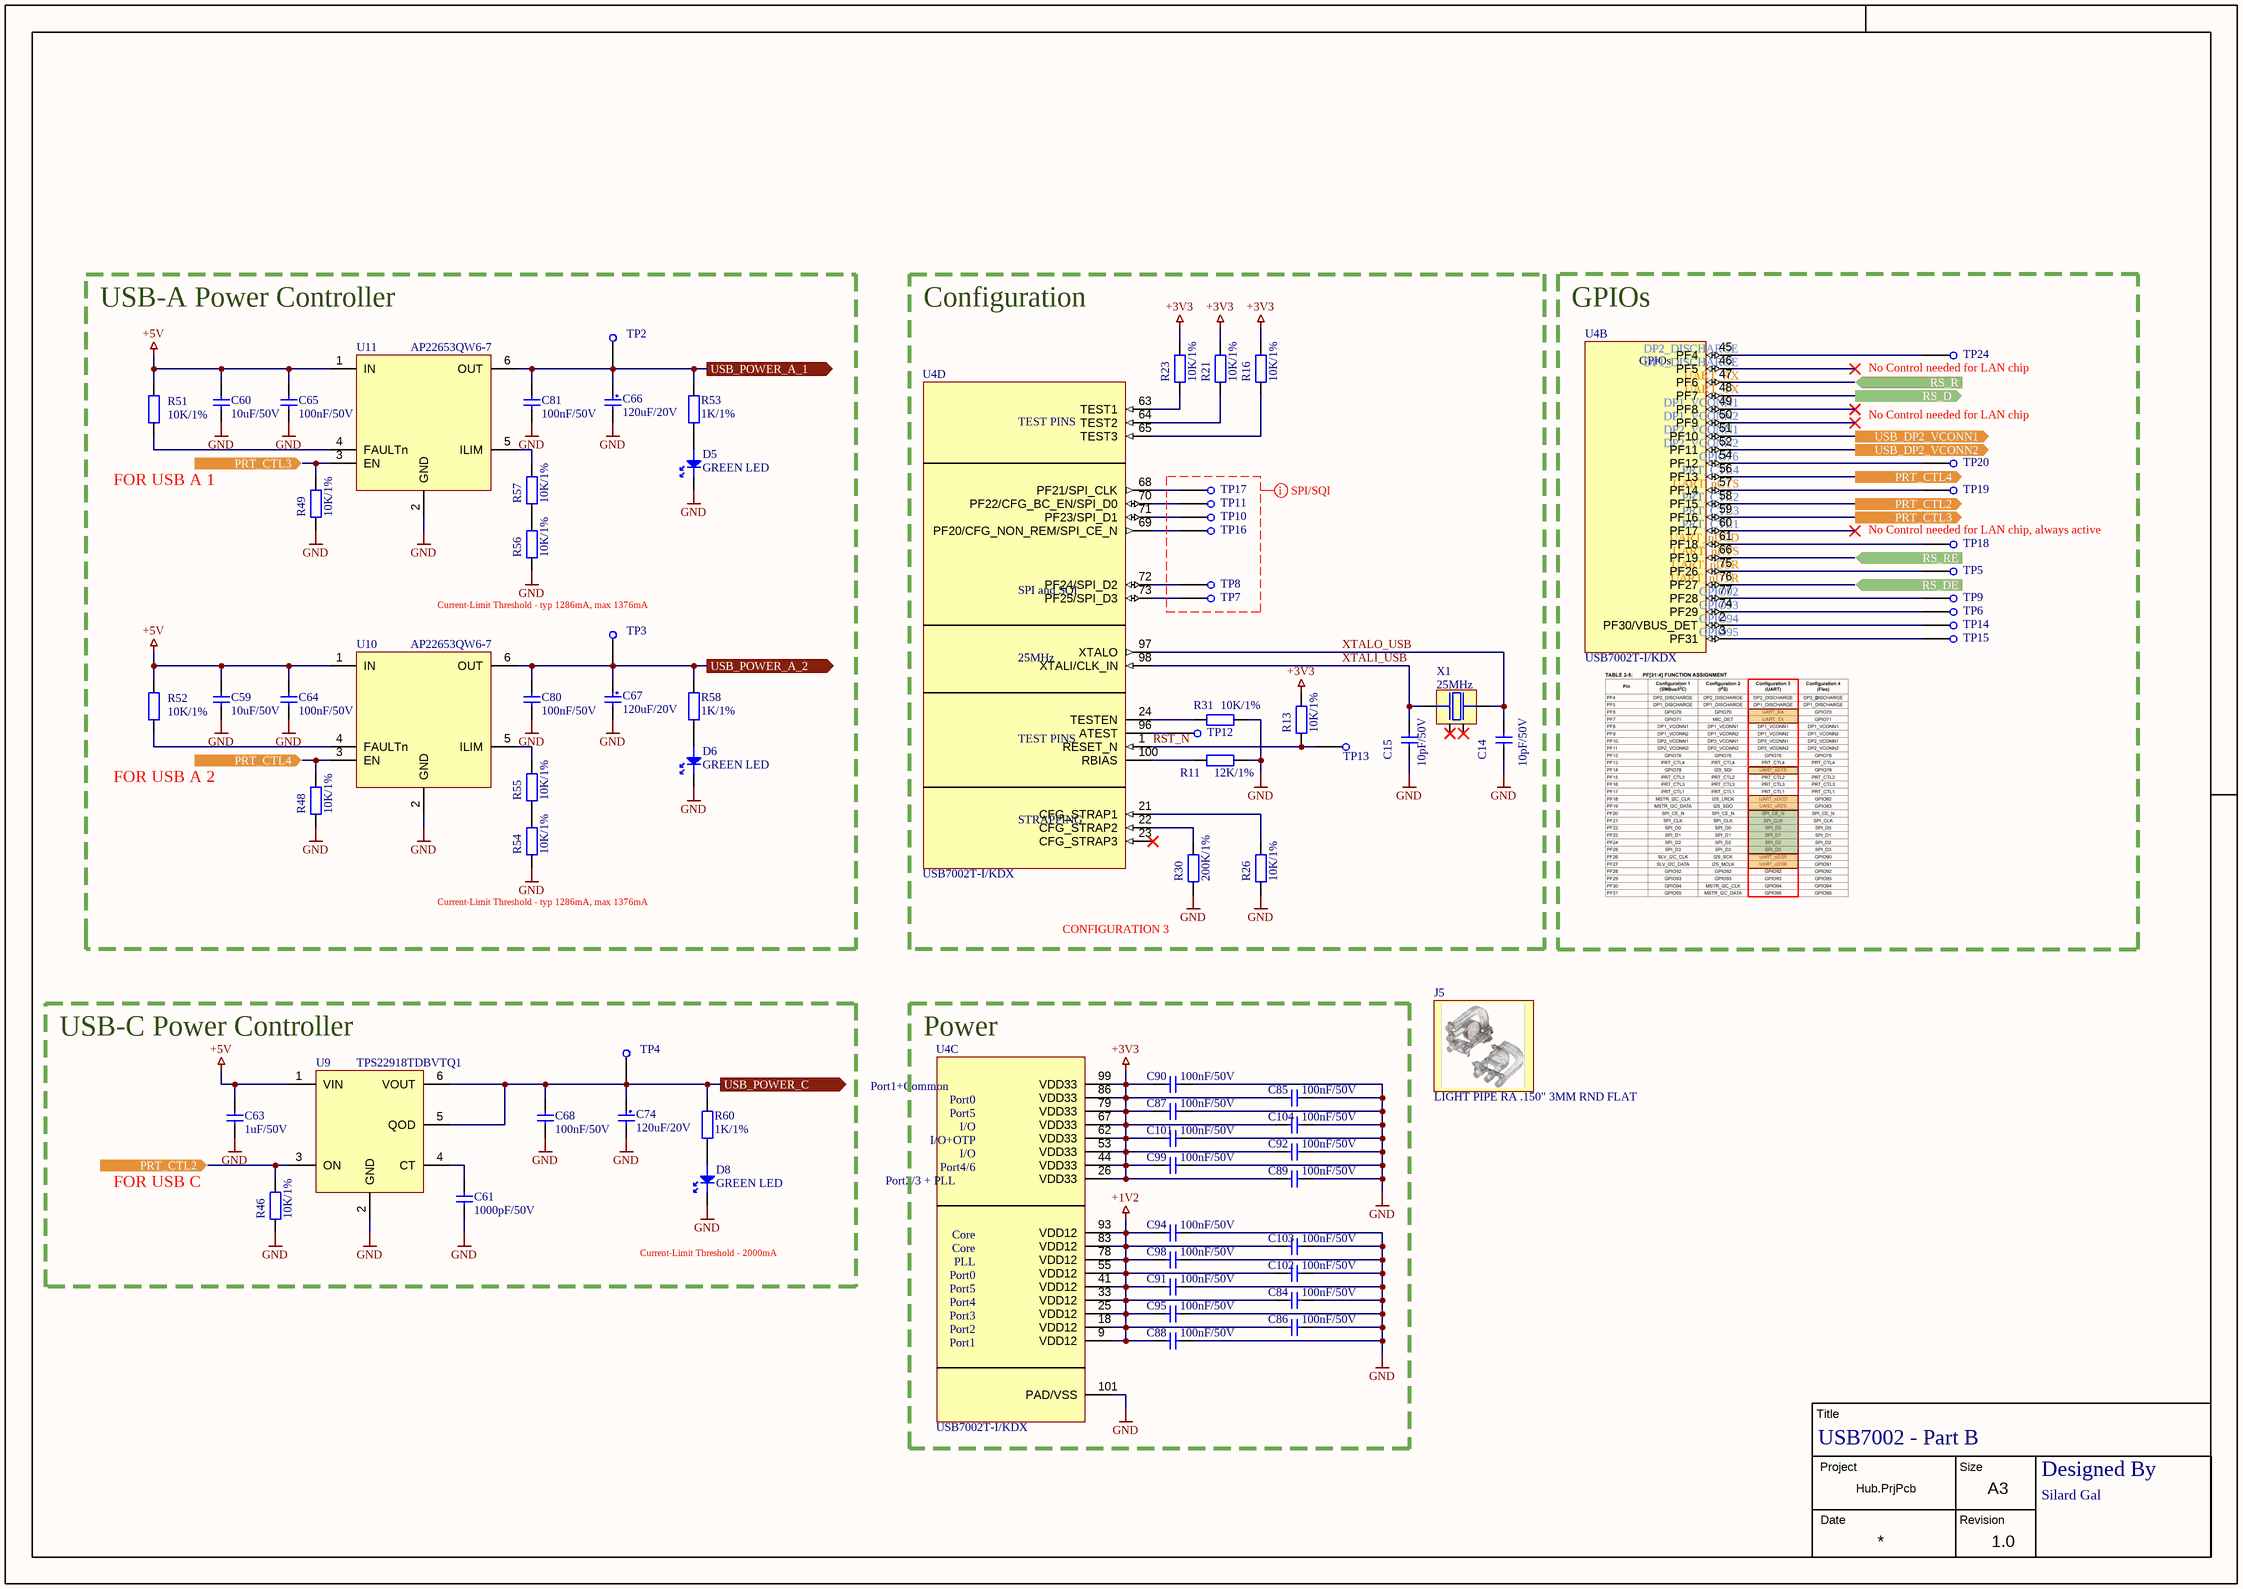
[diagram p4: 05 USB7002-PartB.SchDoc]

### Parts
C14  10pF/50V  [CAPC1005X06N]
C15  10pF/50V  [CAPC1005X06N]
C59  10uF/50V  [CAPC3216X18N]
C60  10uF/50V  [CAPC3216X18N]
C61  1000pF/50V  [CAPC1005X06N]
C63  1uF/50V  [INDC1608X10N]
C64  100nF/50V  [CAPC1005X06N]
C65  100nF/50V  [CAPC1005X06N]
C66  120uF/20V  [CAPAE7366X60M]
C67  120uF/20V  [CAPAE7366X60M]
C68  100nF/50V  [CAPC1005X06N]
C74  120uF/20V  [CAPAE7366X60M]
C80  100nF/50V  [CAPC1005X06N]
C81  100nF/50V  [CAPC1005X06N]
C84  100nF/50V  [CAPC1005X06N]
C85  100nF/50V  [CAPC1005X06N]
C86  100nF/50V  [CAPC1005X06N]
C87  100nF/50V  [CAPC1005X06N]
C88  100nF/50V  [CAPC1005X06N]
C89  100nF/50V  [CAPC1005X06N]
C90  100nF/50V  [CAPC1005X06N]
C91  100nF/50V  [CAPC1005X06N]
C92  100nF/50V  [CAPC1005X06N]
C94  100nF/50V  [CAPC1005X06N]
C95  100nF/50V  [CAPC1005X06N]
C98  100nF/50V  [CAPC1005X06N]
C99  100nF/50V  [CAPC1005X06N]
C101  100nF/50V  [CAPC1005X06N]
C102  100nF/50V  [CAPC1005X06N]
C103  100nF/50V  [CAPC1005X06N]
C104  100nF/50V  [CAPC1005X06N]
D5  GREEN LED  [DIOC1608X06L]
D6  GREEN LED  [DIOC1608X06L]
D8  GREEN LED  [DIOC1608X06L]
J5  LIGHT PIPE RA .150" 3MM RND FLAT  [5151064F]
R11  12K/1%  [RESC1005X04N]
R13  10K/1%  [RESC1005X04N]
R16  10K/1%  [RESC1005X04N]
R21  10K/1%  [RESC1005X04N]
R23  10K/1%  [RESC1005X04N]
R26  10K/1%  [RESC1005X04N]
R30  200K/1%  [RESC1005X04N]
R31  10K/1%  [RESC1005X04N]
R46  10K/1%  [RESC1005X04N]
R48  10K/1%  [RESC1005X04N]
R49  10K/1%  [RESC1005X04N]
R51  10K/1%  [RESC1005X04N]
R52  10K/1%  [RESC1005X04N]
R53  1K/1%  [RESC1005X04N]
R54  10K/1%  [RESC1005X04N]
R55  10K/1%  [RESC1005X04N]
R56  10K/1%  [RESC1005X04N]
R57  10K/1%  [RESC1005X04N]
R58  1K/1%  [RESC1005X04N]
R60  1K/1%  [RESC1005X04N]
TP2  Test Point 1mm  [TEST_POINT_1mm]  (value not drawn)
TP3  Test Point 1mm  [TEST_POINT_1mm]  (value not drawn)
TP4  Test Point 1mm  [TEST_POINT_1mm]  (value not drawn)
TP5  Test Point 1mm  [TEST_POINT_1mm]  (value not drawn)
TP6  Test Point 1mm  [TEST_POINT_1mm]  (value not drawn)
TP7  Test Point 1mm  [TEST_POINT_1mm]  (value not drawn)
TP8  Test Point 1mm  [TEST_POINT_1mm]  (value not drawn)
TP9  Test Point 1mm  [TEST_POINT_1mm]  (value not drawn)
TP10  Test Point 1mm  [TEST_POINT_1mm]  (value not drawn)
TP11  Test Point 1mm  [TEST_POINT_1mm]  (value not drawn)
TP12  Test Point 1mm  [TEST_POINT_1mm]  (value not drawn)
TP13  Test Point 1mm  [TEST_POINT_1mm]  (value not drawn)
TP14  Test Point 1mm  [TEST_POINT_1mm]  (value not drawn)
TP15  Test Point 1mm  [TEST_POINT_1mm]  (value not drawn)
TP16  Test Point 1mm  [TEST_POINT_1mm]  (value not drawn)
TP17  Test Point 1mm  [TEST_POINT_1mm]  (value not drawn)
TP18  Test Point 1mm  [TEST_POINT_1mm]  (value not drawn)
TP19  Test Point 1mm  [TEST_POINT_1mm]  (value not drawn)
TP20  Test Point 1mm  [TEST_POINT_1mm]  (value not drawn)
TP24  Test Point 1mm  [TEST_POINT_1mm]  (value not drawn)
U4  USB7002T-I/KDX  [QFN40P1200X1200X90_HS-101N]  (parts B,C,D of 5)
U9  TPS22918TDBVTQ1  [SOT95P280X145-6N]
U10  AP22653QW6-7  [SOT95P280X145-6N-1]
U11  AP22653QW6-7  [SOT95P280X145-6N-1]
X1  25MHz  [XRCGB25M000F3M00R0]

### Blocks framed on the sheet
USB-A Power Controller: C59 C60 C64-C67 C80 C81 D5 D6 R48 R49 R51-R58 TP2 TP3 U10 U11
Configuration: C14 C15 R11 R13 R16 R21 R23 R26 R30 R31 TP7 TP8 TP10-TP13 TP16 TP17 U4 X1
GPIOs: TP5 TP6 TP9 TP14 TP15 TP18-TP20 TP24 U4
USB-C Power Controller: C61 C63 C68 C74 D8 R46 R60 TP4 U9
Power: C84-C92 C94 C95 C98 C99 C101-C104 U4

### Ports
PRT_CTL2 (in), PRT_CTL2 (out), PRT_CTL3 (in), PRT_CTL3 (out), PRT_CTL4 (in), PRT_CTL4 (out), RS_D (out), RS_DE (in), RS_R (in), RS_RE (in), USB_DP2_VCONN1 (out), USB_DP2_VCONN2 (out), USB_POWER_A_1 (out), USB_POWER_A_2 (out), USB_POWER_C (out)

### Nets
+1V2: C84.2 C86.2 C88.2 C91.2 C94.2 C95.2 C98.2 C102.2 C103.2 U4.9(VDD12) U4.18(VDD12) U4.25(VDD12) U4.33(VDD12) U4.41(VDD12) U4.55(VDD12) U4.78(VDD12) U4.83(VDD12) U4.93(VDD12)
+3V3: C85.2 C87.2 C89.2 C90.2 C92.2 C99.2 C101.2 C104.2 R13.1 R16.1 R21.1 R23.1 U4.26(VDD33) U4.44(VDD33) U4.53(VDD33) U4.62(VDD33) U4.67(VDD33) U4.79(VDD33) U4.86(VDD33) U4.99(VDD33)
+5V: C59.2 C60.2 C63.2 C64.1 C65.1 R51.1 R52.1 U9.1(VIN) U10.1(IN) U11.1(IN)
GND: C14.1 C15.1 C59.1 C60.1 C61.1 C63.1 C64.2 C65.2 C66.2 C67.2 C68.2 C74.2 C80.2 C81.2 C84.1 C85.1 C86.1 C87.1 C88.1 C89.1 C90.1 C91.1 C92.1 C94.1 C95.1 C98.1 C99.1 C101.1 C102.1 C103.1 C104.1 D5.1 D6.1 D8.1 R11.1 R26.2 R30.1 R31.1 R46.2 R48.2 R49.2 R54.2 R56.2 U4.101(PAD/VSS) U9.2(GND) U10.2(GND) U11.2(GND)
RST_N: R13.2 TP13.1 U4.1(RESET_N)
XTALI_USB: C15.2 U4.98(XTALI/CLK_IN) X1.1
XTALO_USB: C14.2 U4.97(XTALO) X1.3
NetC61_2: C61.2 U9.4(CT)
NetC66_1: C66.1 C81.1 R53.2 TP2.1 U11.6(OUT) ; port USB_POWER_A_1
NetC67_1: C67.1 C80.1 R58.2 TP3.1 U10.6(OUT) ; port USB_POWER_A_2
NetC68_1: C68.1 C74.1 R60.2 TP4.1 U9.5(QOD) U9.6(VOUT) ; port USB_POWER_C
NetD5_2: D5.2 R53.1
NetD6_2: D6.2 R58.1
NetD8_2: D8.2 R60.1
NetQ2_2: U4.52(PF11) ; port USB_DP2_VCONN2
NetQ3_2: U4.51(PF10) ; port USB_DP2_VCONN1
NetR5_1: U4.48(PF7) ; port RS_D
NetR7_1: U4.76(PF27) ; port RS_DE
NetR8_1: U4.66(PF19) ; port RS_RE
NetR10_1: U4.47(PF6) ; port RS_R
NetR11_2: R11.2 U4.100(RBIAS)
NetR16_2: R16.2 U4.65(TEST3)
NetR21_2: R21.2 U4.64(TEST2)
NetR23_2: R23.2 U4.63(TEST1)
NetR26_1: R26.1 U4.21(CFG_STRAP1)
NetR30_2: R30.2 U4.22(CFG_STRAP2)
NetR31_2: R31.2 U4.24(TESTEN)
NetR46_1: R46.1 U4.58(PF15) U9.3(ON) ; port PRT_CTL2
NetR48_1: R48.1 U4.56(PF13) U10.3(EN) ; port PRT_CTL4
NetR49_1: R49.1 U4.59(PF16) U11.3(EN) ; port PRT_CTL3
NetR51_2: R51.2 U11.4(FAULTn)
NetR52_2: R52.2 U10.4(FAULTn)
NetR54_1: R54.1 R55.2
NetR55_1: R55.1 U10.5(ILIM)
NetR56_1: R56.1 R57.2
NetR57_1: R57.1 U11.5(ILIM)
NetTP5_1: TP5.1 U4.75(PF26)
NetTP6_1: TP6.1 U4.74(PF29)
NetTP7_1: TP7.1 U4.73(PF25/SPI_D3)
NetTP8_1: TP8.1 U4.72(PF24/SPI_D2)
NetTP9_1: TP9.1 U4.77(PF28)
NetTP10_1: TP10.1 U4.71(PF23/SPI_D1)
NetTP11_1: TP11.1 U4.70(PF22/CFG_BC_EN/SPI_D0)
NetTP12_1: TP12.1 U4.96(ATEST)
NetTP14_1: TP14.1 U4.2(PF30/VBUS_DET)
NetTP15_1: TP15.1 U4.3(PF31)
NetTP16_1: TP16.1 U4.69(PF20/CFG_NON_REM/SPI_CE_N)
NetTP17_1: TP17.1 U4.68(PF21/SPI_CLK)
NetTP18_1: TP18.1 U4.61(PF18)
NetTP19_1: TP19.1 U4.57(PF14)
NetTP20_1: TP20.1 U4.54(PF12)
NetTP24_1: TP24.1 U4.45(PF4)

Not connected (* = marked no-connect by the designer): U4 23(CFG_STRAP3)* 46(PF5)* 49(PF8)* 50(PF9)* 60(PF17)*; X1 2* 4*

### Layout directives
net class SPI/SQI: (no net found under the mark)

### Notes on the sheet
- (near U4) DP2_DISCHARGE
- (near U4) DP1_DISCHARGE
- (near U4) UART_RX
- (near U4) UART_TX
- (near U4) DP1_VCONN1
- (near TP24) No Control needed for LAN chip
- (near U4) DP1_VCONN2
- (near U4) DP2_VCONN1
- (near U4) DP2_VCONN2
- (near U4) GPIO76
- No Control needed for LAN chip
- FOR USB A 1
- (near U4) PRT_CTL4
- (near U4) UART_nCTS
- (near U4) PRT_CTL2
- (near U4) PRT_CTL3
- (near U4) PRT_CTL1
- (near U4) UART_nDCD
- (near TP18) No Control needed for LAN chip, always active
- (near U4) UART_nRTS
- (near U4) UART_nDSR
- (near U4) UART_nDTR
- (near U4) GPIO92
- Current-Limit Threshold - typ 1286mA, max 1376mA
- (near U4) GPIO93
- (near U4) GPIO94
- (near U4) GPIO95
- FOR USB A 2
- (near R54) Current-Limit Threshold - typ 1286mA, max 1376mA
- CONFIGURATION 3
- FOR USB C
- Current-Limit Threshold - 2000mA
- Title
- Project
- Size
- Date
- Revision
- A3
- Designed By
- (in symbol USB7002T-I/KDX, part B) GPIOs
- (in symbol USB7002T-I/KDX, part C) Port1+Common; Port0; Port5; I/O; I/O+OTP; Port4/6; Port2/3 + PLL; Core; PLL; Port4; Port3; Port2; Port1
- (in symbol USB7002T-I/KDX, part D) TEST PINS; SPI and SQI; 25MHz; STRAPPING

### Library data of the parts
C14 C15 = GCM1555C1H100JA16D: 10 pF ±5% 50V Ceramic Capacitor C0G, NP0 0402 (1005 Metric); manufacturer: Murata Electronics; mfr_part_number: GCM1555C1H100JA16D; assembler_number: GCM1555C1H100JA16D; datasheet: https://www.murata.com/-/media/webrenewal/support/library/catalog/products/k35e.ashx?la=en-us&cvid=20200508021757000000
C59 C60 = GRT31CR61H106ME01L: as C16 on sheet 03 POWER; mfr_part_number: GRT31CR61H106ME01L; assembler_number: GRT31CR61H106ME01L; datasheet: https://search.murata.co.jp/Ceramy/image/img/A01X/G101/ENG/GRT31CR61H106ME01-01.pdf
C61 = C0402C102K5RECAUTO: 1000 pF ±10% 50V Ceramic Capacitor X7R 0402 (1005 Metric); manufacturer: KEMET; mfr_part_number: C0402C102K5RECAUTO; assembler_number: C0402C102K5RECAUTO; datasheet: https://connect.kemet.com:7667/gateway/IntelliData-ComponentDocumentation/1.0/download/datasheet/C0402C102K5RECAUTO
C63 = GRT188R61H105KE13D: as C56 on sheet 03 POWER; mfr_part_number: GRT188R61H105KE13D; assembler_number: GRT188R61H105KE13D; datasheet: https://search.murata.co.jp/Ceramy/image/img/A01X/G101/ENG/GRT188R61H105KE13-01.pdf
C64 C65 C68 C80 C81 C84-C92 C94 C95 C98 C99 C101-C104 = GCM155R71H104KE02J: as C9 on sheet 03 POWER; mfr_part_number: GCM155R71H104KE02J; assembler_number: GCM155R71H104KE02J; datasheet: https://search.murata.co.jp/Ceramy/image/img/A01X/G101/ENG/GCM155R71H104KE02-01.pdf
C66 C67 C74 = A768EB127M1DLAS034: 120 µF 20 V Aluminum - Polymer Capacitors Radial, Can - SMD 34mOhm 2000 Hrs @ 125°C; manufacturer: KEMET; mfr_part_number: A768EB127M1DLAS034; assembler_number: A768EB127M1DLAS034; datasheet: https://connect.kemet.com:7667/gateway/IntelliData-ComponentDocumentation/1.0/download/datasheet/A768EB127M1DLAS034
D5 D6 D8 = LTST-C191KGKT: as D7 on sheet 03 POWER; mfr_part_number: LTST-C191KGKT; assembler_number: LTST-C191KGKT; datasheet: https://optoelectronics.liteon.com/upload/download/DS22-2000-228/LTST-C191KGKT.PDF
J5 = 5151064F: Light Pipe 3 High Clear Rigid Board Mount, Press Fit, Right Angle; manufacturer: Dialight; mfr_part_number: 5151064F; assembler_number: 5151064F; datasheet: https://s3-us-west-2.amazonaws.com/catsy.557/Lightpipe_Selector_Guide_D.pdf
R11 = ERJ-2RKF1202X: 12 kOhms ±1% 0.1W, 1/10W Chip Resistor 0402 (1005 Metric) Automotive AEC-Q200 Thick Film; manufacturer: Panasonic Electronic Components; mfr_part_number: ERJ-2RKF1202X; assembler_number: ERJ-2RKF1202X; datasheet: https://industrial.panasonic.com/cdbs/www-data/pdf/RDA0000/AOA0000C304.pdf
R13 R16 R21 R23 R26 R31 R46 R48 R49 R51 R52 R54-R57 = RMCF0402FT10K0: as R61 on sheet 03 POWER; mfr_part_number: RMCF0402FT10K0; assembler_number: RMCF0402FT10K0; datasheet: https://www.seielect.com/Catalog/SEI-RMCF_RMCP.pdf
R30 = RMCF0402FT200K: 200 kOhms ±1% 0.063W, 1/16W Chip Resistor 0402 (1005 Metric) Automotive AEC-Q200 Thick Film; manufacturer: Stackpole Electronics Inc; mfr_part_number: RMCF0402FT200K; assembler_number: RMCF0402FT200K; datasheet: https://www.seielect.com/Catalog/SEI-RMCF_RMCP.pdf
R53 R58 R60 = RMCF0402FT1K00: as R59 on sheet 03 POWER; mfr_part_number: RMCF0402FT1K00; assembler_number: RMCF0402FT1K00; datasheet: https://www.seielect.com/Catalog/SEI-RMCF_RMCP.pdf
TP2-TP20 TP24 = TestPoint
U4 = USB7002T-I/KDX: as U4 on sheet 04 USB7002-PartA; mfr_part_number: USB7002T-I/KDX; assembler_number: USB7002T-I/KDX; datasheet: https://ww1.microchip.com/downloads/en/DeviceDoc/USB7002-Data-Sheet-DS00002670F.pdf
U9 = TPS22918TDBVTQ1: Power Switch/Driver 1:1 N-Channel 2A SOT-23-6; manufacturer: Texas Instruments; mfr_part_number: TPS22918TDBVTQ1; assembler_number: TPS22918TDBVTQ1; datasheet: https://www.ti.com/general/docs/suppproductinfo.tsp?distId=10&gotoUrl=https%3A%2F%2Fwww.ti.com%2Flit%2Fgpn%2Ftps22918-q1
U10 U11 = AP22653QW6-7: Power Switch/Driver 1:1 N-Channel 1.2A SOT-26 (Type A1); manufacturer: Diodes Incorporated; mfr_part_number: AP22653QW6-7; assembler_number: AP22653QW6-7; datasheet: https://www.diodes.com/assets/Datasheets/AP22653Q.pdf
X1 = XRCGB25M000F3M00R0: 25 MHz ±30ppm Crystal 6pF 150 Ohms 4-SMD, No Lead; manufacturer: Murata Electronics; mfr_part_number: XRCGB25M000F3M00R0; assembler_number: XRCGB25M000F3M00R0; datasheet: https://www.murata.com/~/media/webrenewal/campaign/ads/america/timing/p79e.ashx?la=en-us

## Sheet 06 LAN7800.SchDoc: LAN7800
size 420 x 297 mm; SheetNumber: 5; SheetTotal: 7
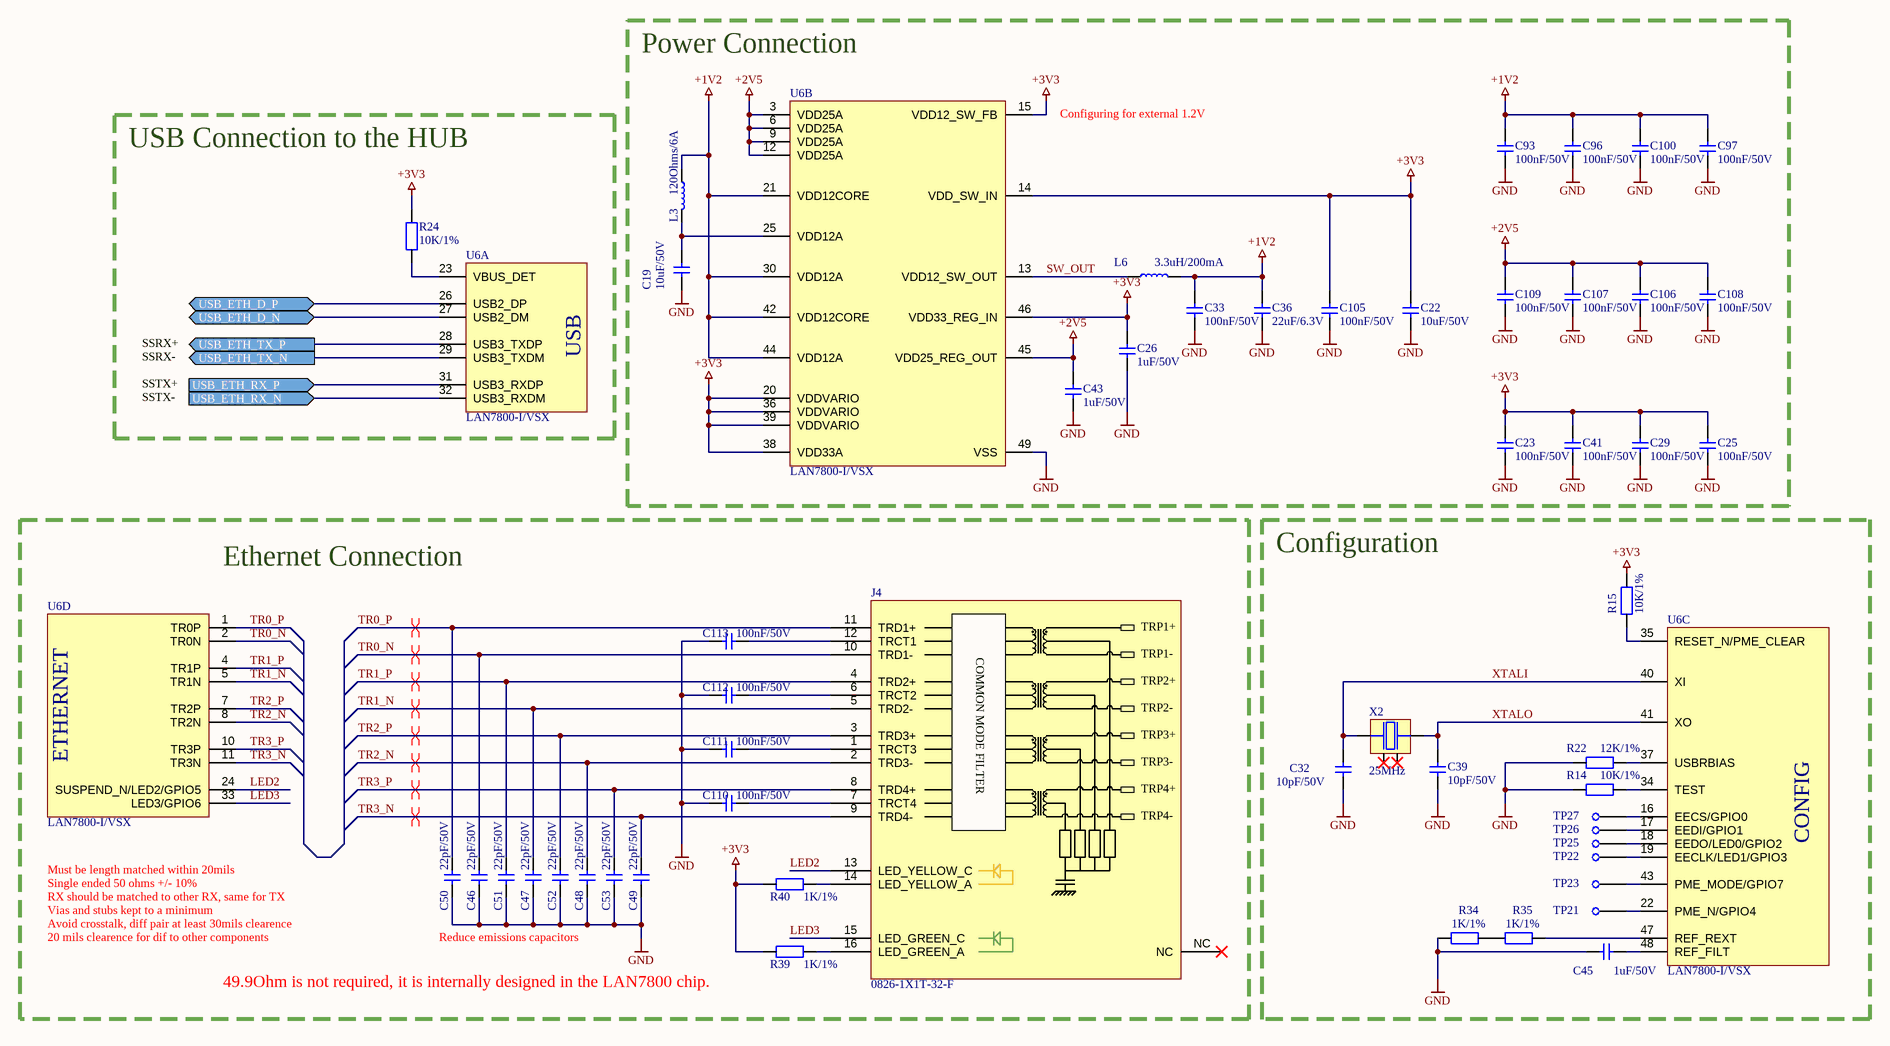
[diagram p5: 06 LAN7800.SchDoc]

### Parts
C19  10uF/50V  [CAPC3216X18N]
C22  10uF/50V  [CAPC3216X18N]
C23  100nF/50V  [CAPC1005X06N]
C25  100nF/50V  [CAPC1005X06N]
C26  1uF/50V  [INDC1608X10N]
C29  100nF/50V  [CAPC1005X06N]
C32  10pF/50V  [CAPC1005X06N]
C33  100nF/50V  [CAPC1005X06N]
C36  22uF/6.3V  [INDC1608X10N]
C39  10pF/50V  [CAPC1005X06N]
C41  100nF/50V  [CAPC1005X06N]
C43  1uF/50V  [INDC1608X10N]
C45  1uF/50V  [INDC1608X10N]
C46  22pF/50V  [CAPC1005X06N]
C47  22pF/50V  [CAPC1005X06N]
C48  22pF/50V  [CAPC1005X06N]
C49  22pF/50V  [CAPC1005X06N]
C50  22pF/50V  [CAPC1005X06N]
C51  22pF/50V  [CAPC1005X06N]
C52  22pF/50V  [CAPC1005X06N]
C53  22pF/50V  [CAPC1005X06N]
C93  100nF/50V  [CAPC1005X06N]
C96  100nF/50V  [CAPC1005X06N]
C97  100nF/50V  [CAPC1005X06N]
C100  100nF/50V  [CAPC1005X06N]
C105  100nF/50V  [CAPC1005X06N]
C106  100nF/50V  [CAPC1005X06N]
C107  100nF/50V  [CAPC1005X06N]
C108  100nF/50V  [CAPC1005X06N]
C109  100nF/50V  [CAPC1005X06N]
C110  100nF/50V  [CAPC1005X06N]
C111  100nF/50V  [CAPC1005X06N]
C112  100nF/50V  [CAPC1005X06N]
C113  100nF/50V  [CAPC1005X06N]
J4  0826-1X1T-32-F  [0826-1X1T-32-F]
L3  120Ohms/6A  [INDC3216X18N]
L6  3.3uH/200mA  [INDP3225X21M]
R14  10K/1%  [RESC1005X04N]
R15  10K/1%  [RESC1005X04N]
R22  12K/1%  [RESC1005X04N]
R24  10K/1%  [RESC1005X04N]
R34  1K/1%  [RESC1005X04N]
R35  1K/1%  [RESC1005X04N]
R39  1K/1%  [RESC1005X04N]
R40  1K/1%  [RESC1005X04N]
TP21  Test Point 1mm  [TEST_POINT_1mm]  (value not drawn)
TP22  Test Point 1mm  [TEST_POINT_1mm]  (value not drawn)
TP23  Test Point 1mm  [TEST_POINT_1mm]  (value not drawn)
TP25  Test Point 1mm  [TEST_POINT_1mm]  (value not drawn)
TP26  Test Point 1mm  [TEST_POINT_1mm]  (value not drawn)
TP27  Test Point 1mm  [TEST_POINT_1mm]  (value not drawn)
U6  LAN7800-I/VSX  [PQFN40P600X600X90_HS-49N]  (parts A,B,C,D of 4)
X2  25MHz  [XRCGB25M000F3M00R0]

### Blocks framed on the sheet
Power Connection: C19 C22 C23 C25 C26 C29 C33 C36 C41 C43 C93 C96 C97 C100 C105-C109 L3 L6 U6
USB Connection to the HUB: R24 U6
Ethernet Connection: C46-C53 C110-C113 J4 R39 R40 U6
Configuration: C32 C39 C45 R14 R15 R22 R34 R35 TP21-TP23 TP25-TP27 U6 X2

### Ports
USB_ETH_D_N (bidir), USB_ETH_D_P (bidir), USB_ETH_RX_N (in), USB_ETH_RX_P (in), USB_ETH_TX_N (out), USB_ETH_TX_P (out)

### Nets
+1V2: C33.1 C36.2 C93.1 C96.1 C97.1 C100.1 L3.1 L6.2 U6.21(VDD12CORE) U6.30(VDD12A) U6.42(VDD12CORE) U6.44(VDD12A)
+2V5: C43.2 C106.1 C107.1 C108.1 C109.1 U6.3(VDD25A) U6.6(VDD25A) U6.9(VDD25A) U6.12(VDD25A) U6.45(VDD25_REG_OUT)
+3V3: C22.2 C23.1 C25.1 C26.2 C29.1 C41.1 C105.1 R15.1 R24.1 R39.2 R40.2 U6.14(VDD_SW_IN) U6.15(VDD12_SW_FB) U6.20(VDDVARIO) U6.36(VDDVARIO) U6.38(VDD33A) U6.39(VDDVARIO) U6.46(VDD33_REG_IN)
GND: C19.1 C22.1 C23.2 C25.2 C26.1 C29.2 C32.1 C33.2 C36.1 C39.1 C41.2 C43.1 C45.2 C46.1 C47.1 C48.1 C49.1 C50.1 C51.1 C52.1 C53.1 C93.2 C96.2 C97.2 C100.2 C105.2 C106.2 C107.2 C108.2 C109.2 C110.2 C111.2 C112.2 C113.2 R14.1 R22.2 R34.1 U6.49(VSS)
LAN_D_N: U6.27(USB2_DM) ; port USB_ETH_D_N
LAN_D_P: U6.26(USB2_DP) ; port USB_ETH_D_P
LAN_RX_N: U6.32(USB3_RXDM) ; port USB_ETH_RX_N
LAN_RX_P: U6.31(USB3_RXDP) ; port USB_ETH_RX_P
LAN_TX_N: U6.29(USB3_TXDM) ; port USB_ETH_TX_N
LAN_TX_P: U6.28(USB3_TXDP) ; port USB_ETH_TX_P
LED2: J4.13(LED_YELLOW_C) U6.24(SUSPEND_N/LED2/GPIO5)
LED3: J4.15(LED_GREEN_C) U6.33(LED3/GPIO6)
SW_OUT: L6.1 U6.13(VDD12_SW_OUT)
TR0_N: C46.2 J4.10(TRD1-) U6.2(TR0N)
TR0_P: C50.2 J4.11(TRD1+) U6.1(TR0P)
TR1_N: C47.2 J4.5(TRD2-) U6.5(TR1N)
TR1_P: C51.2 J4.4(TRD2+) U6.4(TR1P)
TR2_N: C48.2 J4.2(TRD3-) U6.8(TR2N)
TR2_P: C52.2 J4.3(TRD3+) U6.7(TR2P)
TR3_N: C49.2 J4.9(TRD4-) U6.11(TR3N)
TR3_P: C53.2 J4.8(TRD4+) U6.10(TR3P)
XTALI: C32.2 U6.40(XI) X2.3
XTALO: C39.2 U6.41(XO) X2.1
NetC19_2: C19.2 L3.2 U6.25(VDD12A)
NetC45_1: C45.1 U6.48(REF_FILT)
NetC110_1: C110.1 J4.7(TRCT4)
NetC111_1: C111.1 J4.1(TRCT3)
NetC112_1: C112.1 J4.6(TRCT2)
NetC113_1: C113.1 J4.12(TRCT1)
NetJ4_14: J4.14(LED_YELLOW_A) R40.1
NetJ4_16: J4.16(LED_GREEN_A) R39.1
NetR14_2: R14.2 U6.34(TEST)
NetR15_2: R15.2 U6.35(RESET_N/PME_CLEAR)
NetR22_1: R22.1 U6.37(USBRBIAS)
NetR24_2: R24.2 U6.23(VBUS_DET)
NetR34_2: R34.2 R35.1
NetR35_2: R35.2 U6.47(REF_REXT)
NetTP21_1: TP21.1 U6.22(PME_N/GPIO4)
NetTP22_1: TP22.1 U6.19(EECLK/LED1/GPIO3)
NetTP23_1: TP23.1 U6.43(PME_MODE/GPIO7)
NetTP25_1: TP25.1 U6.18(EEDO/LED0/GPIO2)
NetTP26_1: TP26.1 U6.17(EEDI/GPIO1)
NetTP27_1: TP27.1 U6.16(EECS/GPIO0)

Not connected (* = marked no-connect by the designer): J4 NC*; X2 2* 4*

### Layout directives
differential pair; differential pair class ETHERNET: TR0_N, TR0_P, TR1_N, TR1_P, TR2_N, TR2_P, TR3_N, TR3_P

### Notes on the sheet
- Configuring for external 1.2V
- SSRX+
- SSRX-
- SSTX+
- SSTX-
- Must be length matched within 20mils
- Single ended 50 ohms +/- 10%
- RX should be matched to other RX, same for TX
- Vias and stubs kept to a minimum
- Avoid crosstalk, diff pair at least 30mils clearence
- 20 mils clearence for dif to other components
- Reduce emissions capacitors
- (near R39) 49.9Ohm is not required, it is internally designed in the LAN7800 chip.
- Title
- Project
- Size
- Date
- Revision
- A3
- Designed By
- (in symbol 0826-1X1T-32-F) TRP1+; COMMON MODE FILTER; TRP1-; TRP2+; TRP2-; TRP3+; TRP3-; TRP4+; TRP4-
- (in symbol LAN7800-I/VSX, part A) USB
- (in symbol LAN7800-I/VSX, part C) CONFIG
- (in symbol LAN7800-I/VSX, part D) ETHERNET

### Library data of the parts
C19 C22 = GRT31CR61H106ME01L: as C16 on sheet 03 POWER; mfr_part_number: GRT31CR61H106ME01L; assembler_number: GRT31CR61H106ME01L; datasheet: https://search.murata.co.jp/Ceramy/image/img/A01X/G101/ENG/GRT31CR61H106ME01-01.pdf
C23 C25 C29 C33 C41 C93 C96 C97 C100 C105-C113 = GCM155R71H104KE02J: as C9 on sheet 03 POWER; mfr_part_number: GCM155R71H104KE02J; assembler_number: GCM155R71H104KE02J; datasheet: https://search.murata.co.jp/Ceramy/image/img/A01X/G101/ENG/GCM155R71H104KE02-01.pdf
C26 C43 C45 = GRT188R61H105KE13D: as C56 on sheet 03 POWER; mfr_part_number: GRT188R61H105KE13D; assembler_number: GRT188R61H105KE13D; datasheet: https://search.murata.co.jp/Ceramy/image/img/A01X/G101/ENG/GRT188R61H105KE13-01.pdf
C32 C39 = GCM1555C1H100JA16D: as C14 on sheet 05 USB7002-PartB; mfr_part_number: GCM1555C1H100JA16D; assembler_number: GCM1555C1H100JA16D; datasheet: https://www.murata.com/-/media/webrenewal/support/library/catalog/products/k35e.ashx?la=en-us&cvid=20200508021757000000
C36 = GRT188C80J226ME13D: 22 µF ±20% 6.3V Ceramic Capacitor X6S 0603 (1608 Metric); manufacturer: Murata Electronics; mfr_part_number: GRT188C80J226ME13D; assembler_number: GRT188C80J226ME13D; datasheet: https://search.murata.co.jp/Ceramy/image/img/A01X/G101/ENG/GRT188C80J226ME13-01.pdf
C46-C53 = CL05C220JB51PNC: 22 pF ±5% 50V Ceramic Capacitor C0G, NP0 0402 (1005 Metric); manufacturer: Samsung Electro-Mechanics; mfr_part_number: CL05C220JB51PNC; assembler_number: CL05C220JB51PNC; datasheet: https://media.digikey.com/pdf/Data%20Sheets/Samsung%20PDFs/CL05C220JB51PNC_Spec.pdf
J4 = 0826-1X1T-32-F: 1 Port RJ45Through Hole 10/100/1000 Base-T, AutoMDIX; manufacturer: Bel Fuse Inc.; mfr_part_number: 0826-1X1T-32-F; assembler_number: 0826-1X1T-32-F; datasheet: https://www.belfuse.com/resources/drawings/magneticsolutions/dr-mag-0826-1x1t-32-f.pdf
L3 = BLM31KN121SN1L: as L4 on sheet 03 POWER; mfr_part_number: BLM31KN121SN1L; assembler_number: BLM31KN121SN1L; datasheet: https://www.murata.com/en-us/products/productdata/8801529331742/ENFA0091.pdf
L6 = B82422A1332J100: 3.3 µH Unshielded Drum Core, Wirewound Inductor 200 mA 1.2Ohm Max 2-SMD, J-Lead; manufacturer: EPCOS - TDK Electronics; mfr_part_number: B82422A1332J100; assembler_number: B82422A1332J100; datasheet: https://www.tdk-electronics.tdk.com/inf/30/db/ind_2008/b82422a_100.pdf
R14 R15 R24 = RMCF0402FT10K0: as R61 on sheet 03 POWER; mfr_part_number: RMCF0402FT10K0; assembler_number: RMCF0402FT10K0; datasheet: https://www.seielect.com/Catalog/SEI-RMCF_RMCP.pdf
R22 = ERJ-2RKF1202X: as R11 on sheet 05 USB7002-PartB; mfr_part_number: ERJ-2RKF1202X; assembler_number: ERJ-2RKF1202X; datasheet: https://industrial.panasonic.com/cdbs/www-data/pdf/RDA0000/AOA0000C304.pdf
R34 R35 R39 R40 = RMCF0402FT1K00: as R59 on sheet 03 POWER; mfr_part_number: RMCF0402FT1K00; assembler_number: RMCF0402FT1K00; datasheet: https://www.seielect.com/Catalog/SEI-RMCF_RMCP.pdf
TP21-TP23 TP25-TP27 = TestPoint
U6 = LAN7800-I/VSX: Ethernet Controller 10/100/1000 Base-TX PHY Interface 48-SQFN (6x6); manufacturer: Microchip Technology; mfr_part_number: LAN7800-I/VSX; assembler_number: LAN7800-I/VSX; datasheet: https://ww1.microchip.com/downloads/en/DeviceDoc/LAN7800-Data-Sheet-DS00001992G.pdf
X2 = XRCGB25M000F3M00R0: as X1 on sheet 05 USB7002-PartB; mfr_part_number: XRCGB25M000F3M00R0; assembler_number: XRCGB25M000F3M00R0; datasheet: https://www.murata.com/~/media/webrenewal/campaign/ads/america/timing/p79e.ashx?la=en-us